# EAGLE design ArtemisDevKit (EAGLE 9.2.0)
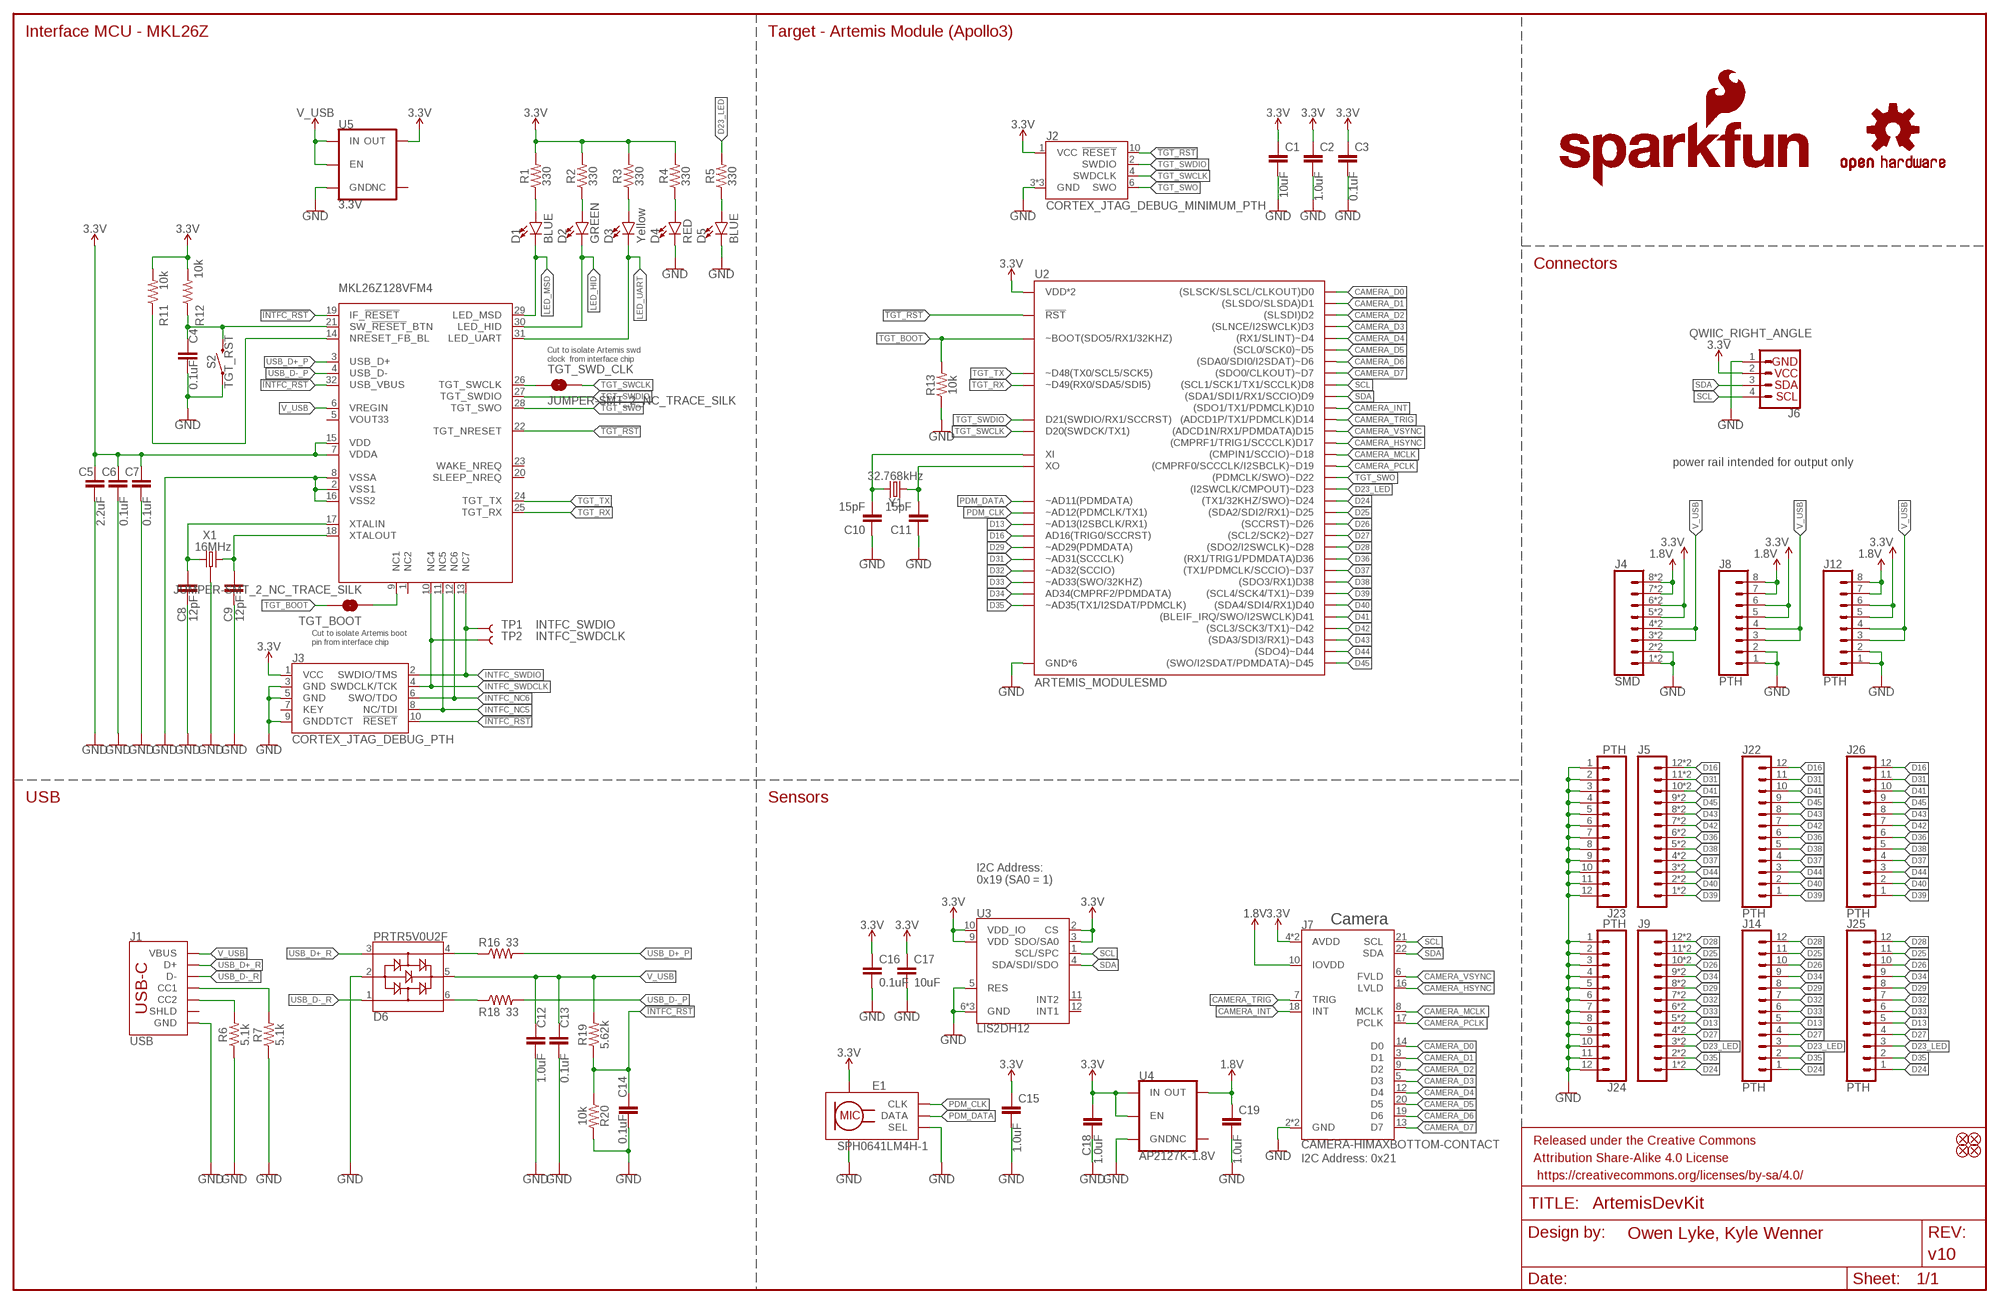
[diagram p0: schematic, sheet 1]

## Parts
C1  10uF  10UF-0603-6.3V-20%  [0603]
C2  1.0uF  1.0UF-0603-16V-10%  [0603]
C3  0.1uF  0.1UF-0603-25V-5%  [0603]
C4  0.1uF  0.1UF-0603-25V-5%  [0603]
C5  2.2uF  2.2UF-0603-10V-20%  [0603]
C6  0.1uF  0.1UF-0603-25V-5%  [0603]
C7  0.1uF  0.1UF-0603-25V-5%  [0603]
C8  12pF  12PF-0603-50V-5%  [0603]
C9  12pF  12PF-0603-50V-5%  [0603]
C10  15pF  15PF-0603-50V-5%  [0603]
C11  15pF  15PF-0603-50V-5%  [0603]
C12  1.0uF  1.0UF-0603-16V-10%  [0603]
C13  0.1uF  0.1UF-0603-25V-5%  [0603]
C14  0.1uF  0.1UF-0603-25V-5%  [0603]
C15  1.0uF  1.0UF-0603-16V-10%  [0603]
C16  0.1uF  0.1UF-0603-25V-5%  [0603]
C17  10uF  10UF-0603-6.3V-20%  [0603]
C18  1.0uF  1.0UF-0603-16V-10%  [0603]
C19  1.0uF  1.0UF-0603-16V-10%  [0603]
D1  BLUE  LED-BLUE0603  [LED-0603]
D2  GREEN  LED-GREEN0603  [LED-0603]
D3  Yellow  LED-YELLOW0603  [LED-0603]
D4  RED  LED-RED0603  [LED-0603]
D5  BLUE  LED-BLUE0603  [LED-0603]
D6  PRTR5V0U2F  [SOT886]
E1  SPH0641LM4H-1  SPH0641LM4H-1_MICROPHONE  [SPH0641LM4H-1_MICROPHONE]
FD1  FIDUCIAL1X2  [FIDUCIAL-1X2]
FD2  FIDUCIAL1X2  [FIDUCIAL-1X2]
FD3  FIDUCIAL1X2  [FIDUCIAL-1X2]
FD4  FIDUCIAL1X2  [FIDUCIAL-1X2]
FRAME1  FRAME-LEDGER  [CREATIVE_COMMONS]
J1  USB  USB_C_2-LAYER  [USB-C-16P]
J2  CORTEX_JTAG_DEBUG_MINIMUM_PTH  [2X5-PTH-1.27MM]
J3  CORTEX_JTAG_DEBUG_PTH  [2X5-PTH-1.27MM]
J4  SMD  CONN_08SMD-COMBO-FEMALE  [1X08_SMD_COMBINED]
J5  CONN_12SMD_COMBINED  [1X12_SMD_COMBINED]
J6  QWIIC_RIGHT_ANGLE  QWIIC_CONNECTORJS-1MM  [JST04_1MM_RA]
J7  CAMERA-HIMAXBOTTOM-CONTACT  [FPC-24-AMPHENOL-SFV24R-1STE1HLF]
J8  PTH  CONN_08NO_SILK_DNP  [1X08_NO_SILK]
J9  CONN_12SMD_COMBINED  [1X12_SMD_COMBINED]
J12  PTH  CONN_08NO_SILK_DNP  [1X08_NO_SILK]
J14  PTH  CONN_12NO_SILK  [1X12_NO_SILK]
J22  PTH  CONN_12NO_SILK  [1X12_NO_SILK]
J23  PTH  CONN_12NO_SILK  [1X12_NO_SILK]
J24  PTH  CONN_12NO_SILK  [1X12_NO_SILK]
J25  PTH  CONN_12NO_SILK  [1X12_NO_SILK]
J26  PTH  CONN_12NO_SILK  [1X12_NO_SILK]
LOGO1  OSHW-LOGOS  [OSHW-LOGO-S]
LOGO2  SFE_LOGO_NAME_FLAME.2_INCH  [SFE_LOGO_NAME_FLAME_.2]
R1  330  330OHM-0603-1/10W-1%  [0603]
R2  330  330OHM-0603-1/10W-1%  [0603]
R3  330  330OHM-0603-1/10W-1%  [0603]
R4  330  330OHM-0603-1/10W-1%  [0603]
R5  330  330OHM-0603-1/10W-1%  [0603]
R6  5.1k  5.1KOHM5.1KOHM-0603-1/10W-1%  [0603]
R7  5.1k  5.1KOHM5.1KOHM-0603-1/10W-1%  [0603]
R11  10k  10KOHM-0603-1/10W-1%  [0603]
R12  10k  10KOHM-0603-1/10W-1%  [0603]
R13  10k  10KOHM-0603-1/10W-1%  [0603]
R16  33  33OHM-0603-1/10W-1%  [0603]
R18  33  33OHM-0603-1/10W-1%  [0603]
R19  5.62k  5.62KOHM-0603-1/10W-1%  [0603]
R20  10k  10KOHM-0603-1/10W-1%  [0603]
S2  TGT_RST  MOMENTARY-SWITCH-SPST-SMD-5.2MM-TALL  [TACTILE_SWITCH_SMD_5.2MM]
TGT_BOOT  JUMPER-SMT_2_NC_TRACE_SILK  [SMT-JUMPER_2_NC_TRACE_SILK]
TGT_SWD_CLK  JUMPER-SMT_2_NC_TRACE_SILK  [SMT-JUMPER_2_NC_TRACE_SILK]
TP1  INTFC_SWDIO  TEST-POINT3  [PAD.03X.03]
TP2  INTFC_SWDCLK  TEST-POINT3  [PAD.03X.03]
U1  DAPLINK_KL26Z128VFM4  [QFN-32-NOPAD]
U2  ARTEMIS_MODULESMD  [ARTEMIS_FP]
U3  LIS2DH12  [LGA-12-LISDH12]
U4  AP2127K-1.8V  V_REG_AP2127K-1.8V  [SOT23-5]
U5  3.3V  V_REG_AP2112K-3.3V  [SOT23-5]
X1  16MHz  CRYSTAL-16MHZ_SMALL  [CRYSTAL-SMD-2X2.5MM]
Y1  32.768kHz  CRYSTAL-32.768KHZSMD-3.2X1.5  [CRYSTAL-SMD-3.2X1.5MM]

## Nets
1.8V: C19.1 J4.7 J4.7@2 J4.8 J4.8@2 J7.10(IOVDD) J8.7 J8.8 J12.7 J12.8 U4.5(OUT)
3.3V: C1.1 C2.1 C3.1 C5.1 C6.1 C7.1 C15.1 C16.1 C17.1 C18.1 E1.5(VDD) J2.1(VCC) J3.1(VCC) J4.5 J4.5@2 J4.6 J4.6@2 J6.2 J7.4(AVDD) J7.11(AVDD) J8.5 J8.6 J12.5 J12.6 R1.2 R2.2 R3.2 R4.2 R11.2 R12.2 U1.7(VDDA) U1.15(VDD) U2.VDD@36(VDD*2) U2.VDD@37(VDD*2) U3.2(CS) U3.3(SDO/SA0) U3.9(VDD) U3.10(VDD_IO) U4.1(IN) U4.3(EN) U5.5(OUT)
!INTFC_RST: C14.1 J3.10(!RESET) R19.1 R20.1 U1.19(IF_!RESET) U1.32(USB_VBUS)
!RST!_BTN: C4.1 R12.1 S2.3 U1.21(SW_!RESET!_BTN)
!TGT_RST: J2.10(!RESET) U1.22(TGT_NRESET) U2.~RST(!RST)
CAMERA_D0: J7.14(D0) U2.D0((SLSCK/SLSCL/CLKOUT)D0)
CAMERA_D1: J7.3(D1) U2.D1((SLSDO/SLSDA)D1)
CAMERA_D2: J7.9(D2) U2.D2((SLSDI)D2)
CAMERA_D3: J7.5(D3) U2.D3((SLNCE/I2SWCLK)D3)
CAMERA_D4: J7.12(D4) U2.~D4((RX1/SLINT)~D4)
CAMERA_D5: J7.20(D5) U2.~D5((SCL0/SCK0)~D5)
CAMERA_D6: J7.19(D6) U2.~D6((SDA0/SDI0/I2SDAT)~D6)
CAMERA_D7: J7.13(D7) U2.D7((SDO0/CLKOUT)~D7)
CAMERA_HSYNC: J7.16(LVLD) U2.D17((CMPRF1/TRIG1/SCCCLK)D17)
CAMERA_INT: J7.18(INT) U2.D10((SDO1/TX1/PDMCLK)D10)
CAMERA_MCLK: J7.8(MCLK) U2.~D18((CMPIN1/SCCIO)~D18)
CAMERA_PCLK: J7.17(PCLK) U2.~D19((CMPRF0/SCCCLK/I2SBCLK)~D19)
CAMERA_TRIG: J7.7(TRIG) U2.D14((ADCD1P/TX1/PDMCLK)D14)
CAMERA_VSYNC: J7.6(FVLD) U2.D15((ADCD1N/RX1/PDMDATA)D15)
D13: J9.5 J9.5@2 J14.5 J25.5 U2.~AD13(~AD13(I2SBCLK/RX1))
D16: J5.12 J5.12@2 J22.12 J26.12 U2.AD16(AD16(TRIG0/SCCRST))
D23_LED: J9.3 J9.3@2 J14.3 J25.3 R5.2 U2.~D23((I2SWCLK/CMPOUT)~D23)
D24: J9.1 J9.1@2 J14.1 J25.1 U2.~D24((TX1/32KHZ/SWO)~D24)
D25: J9.11 J9.11@2 J14.11 J25.11 U2.~D25((SDA2/SDI2/RX1)~D25)
D26: J9.10 J9.10@2 J14.10 J25.10 U2.~D26((SCCRST)~D26)
D27: J9.4 J9.4@2 J14.4 J25.4 U2.~D27((SCL2/SCK2)~D27)
D28: J9.12 J9.12@2 J14.12 J25.12 U2.~D28((SDO2/I2SWCLK)~D28)
D29: J9.8 J9.8@2 J14.8 J25.8 U2.~AD29(~AD29(PDMDATA))
D31: J5.11 J5.11@2 J22.11 J26.11 U2.~AD31(~AD31(SCCCLK))
D32: J9.7 J9.7@2 J14.7 J25.7 U2.~AD32(~AD32(SCCIO))
D33: J9.6 J9.6@2 J14.6 J25.6 U2.~AD33/SWO(~AD33(SWO/32KHZ))
D34: J9.9 J9.9@2 J14.9 J25.9 U2.AD34(AD34(CMPRF2/PDMDATA))
D35: J9.2 J9.2@2 J14.2 J25.2 U2.~AD35(~AD35(TX1/I2SDAT/PDMCLK))
D36: J5.6 J5.6@2 J22.6 J26.6 U2.D36((RX1/TRIG1/PDMDATA)D36)
D37: J5.4 J5.4@2 J22.4 J26.4 U2.~D37((TX1/PDMCLK/SCCIO)~D37)
D38: J5.5 J5.5@2 J22.5 J26.5 U2.D38((SDO3/RX1)D38)
D39: J5.1 J5.1@2 J22.1 J26.1 U2.~D39((SCL4/SCK4/TX1)~D39)
D40: J5.2 J5.2@2 J22.2 J26.2 U2.D40((SDA4/SDI4/RX1)D40)
D41: J5.10 J5.10@2 J22.10 J26.10 U2.D41((BLEIF_IRQ/SWO/I2SWCLK)D41)
D42: J5.7 J5.7@2 J22.7 J26.7 U2.~D42((SCL3/SCK3/TX1)~D42)
D43: J5.8 J5.8@2 J22.8 J26.8 U2.~D43((SDA3/SDI3/RX1)~D43)
D44: J5.3 J5.3@2 J22.3 J26.3 U2.~D44((SDO4)~D44)
D45: J5.9 J5.9@2 J22.9 J26.9 U2.~D45((SWO/I2SDAT/PDMDATA)~D45)
GND: C1.2 C2.2 C3.2 C4.2 C5.2 C6.2 C7.2 C8.2 C9.2 C10.1 C11.1 C12.2 C13.2 C14.2 C15.2 C16.2 C17.2 C18.2 C19.2 D4.C D5.C D6.2 E1.2(SEL) E1.3(GND) E1.6(GND) E1.7(GND) E1.8(GND) J1.GND J1.GND2(GND) J2.3(GND) J2.5(GND) J2.9(GND) J3.3(GND) J3.5(GND) J3.9(GNDDTCT) J4.1 J4.1@2 J4.2 J4.2@2 J6.1 J7.2(GND) J7.15(GND) J8.1 J8.2 J12.1 J12.2 J23.1 J23.2 J23.3 J23.4 J23.5 J23.6 J23.7 J23.8 J23.9 J23.10 J23.11 J23.12 J24.1 J24.2 J24.3 J24.4 J24.5 J24.6 J24.7 J24.8 J24.9 J24.10 J24.11 J24.12 R6.1 R7.1 R13.1 R20.2 S2.1 U1.2(VSS1) U1.8(VSSA) U1.16(VSS2) U2.GND@1(GND*6) U2.GND@22(GND*6) U2.GND@38(GND*6) U2.GND@39(GND*6) U2.GND@47(GND*6) U2.GND@59(GND*6) U3.5(RES) U3.6(GND) U3.7(GND) U3.8(GND) U4.2(GND) U5.2(GND) X1.P2(GND) X1.P4(GND)
INTFC_NC5: J3.8(NC/TDI) U1.11(NC5)
INTFC_NC6: J3.6(SWO/TDO) U1.12(NC6)
INTFC_SWDCLK: J3.4(SWDCLK/TCK) TP2.P$1 U1.10(NC4)
INTFC_SWDIO: J3.2(SWDIO/TMS) TP1.P$1 U1.13(NC7)
LED_HID: D2.C U1.30(LED_HID)
LED_MSD: D1.C U1.29(LED_MSD)
LED_UART: D3.C U1.31(LED_UART)
N$1: D1.A R1.1
N$2: D2.A R2.1
N$3: D3.A R3.1
N$4: J1.B5(CC2) R6.2
N$5: J1.A5(CC1) R7.2
N$6: D5.A R5.1
N$7: D4.A R4.1
N$8: D6.4 R16.1
N$9: D6.6 R18.1
N$10: R11.1 U1.14(NRESET_FB_BL)
N$12: TGT_SWD_CLK.1 U1.26(TGT_SWCLK)
N$13: C8.1 U1.17(XTALIN) X1.P1
N$14: C10.2 U2.XI Y1.P$2
N$15: C11.2 U2.XO Y1.P$1
N$16: C9.1 U1.18(XTALOUT) X1.P3
N$18: TGT_BOOT.1 U1.9(NC1)
PDM_CLK: E1.4(CLK) U2.~AD12(~AD12(PDMCLK/TX1))
PDM_DATA: E1.1(DATA) U2.~AD11(~AD11(PDMDATA))
SCL: J6.4 J7.21(SCL) U2.D8((SCL1/SCK1/TX1/SCCLK)D8) U3.1(SCL/SPC)
SDA: J6.3 J7.22(SDA) U2.D9((SDA1/SDI1/RX1/SCCIO)D9) U3.4(SDA/SDI/SDO)
TGT_BOOT: R13.2 TGT_BOOT.2 U2.BOOT(~BOOT(SDO5/RX1/32KHZ))
TGT_RX: U1.25(TGT_RX) U2.RXI-0(~D49(RX0/SDA5/SDI5))
TGT_SWCLK: J2.4(SWDCLK) TGT_SWD_CLK.2 U2.SWDCK(D20(SWDCK/TX1))
TGT_SWDIO: J2.2(SWDIO) U1.27(TGT_SWDIO) U2.SWDIO(D21(SWDIO/RX1/SCCRST))
TGT_SWO: J2.6(SWO) U1.28(TGT_SWO) U2.~D22((PDMCLK/SWO)~D22)
TGT_TX: U1.24(TGT_TX) U2.TXO-0(~D48(TX0/SCL5/SCK5))
USB_D+_P: R16.2 U1.3(USB_D+)
USB_D+_R: D6.3 J1.A6(D+) J1.B6(D+)
USB_D-_P: R18.2 U1.4(USB_D-)
USB_D-_R: D6.1 J1.A7(D-) J1.B7(D-)
V_USB: C12.1 C13.1 D6.5 J1.VBUS1(VBUS) J1.VBUS2(VBUS) J4.3 J4.3@2 J4.4 J4.4@2 J8.3 J8.4 J12.3 J12.4 R19.2 U1.6(VREGIN) U5.1(IN) U5.3(EN)
Unconnected: J1.SHLD1(SHLD) J1.SHLD2(SHLD) J1.SHLD3(SHLD) J1.SHLD4(SHLD) J1.SHLD5(SHLD) J1.SHLD6(SHLD) J1.SHLD7(SHLD) J1.SHLD8(SHLD) J3.7(KEY) J7.MNT1@0(MNT1) J7.MNT1@1(MNT1) J7.MNT2@0(MNT2) J7.MNT2@1(MNT2) U1.1(NC2) U1.5(VOUT33) U1.20(SLEEP_NREQ) U1.23(WAKE_NREQ) U3.11(INT2) U3.12(INT1) U4.4(NC) U5.4(NC)

## Notes on the sheet
- Interface MCU - MKL26Z | Target - Artemis Module (Apollo3)
- Connectors
- Cut to isolate Artemis swd
  clock  from interface chip
- power rail intended for output only
- Cut to isolate Artemis boot
  pin from interface chip
- USB | Sensors
- I2C Address:
  0x19 (SA0 = 1)
- Camera
- I2C Address: 0x21

## Library data of the parts
C1 C17 = SparkFun-Capacitors:10UF: 10.0µF ceramic capacitors A capacitor is a passive two-terminal electrical component used to store electrical energy temporarily in an electric field.; PROD_ID: CAP-11015
C2 C12 C15 C18 C19 = SparkFun-Capacitors:1.0UF: 1µF ceramic capacitors A capacitor is a passive two-terminal electrical component used to store electrical energy temporarily in an electric field.; PROD_ID: CAP-00868
C3 C4 C6 C7 C13 C14 C16 = SparkFun-Capacitors:0.1UF: 0.1µF ceramic capacitors A capacitor is a passive two-terminal electrical component used to store electrical energy temporarily in an electric field.; PROD_ID: CAP-08604
C5 = SparkFun-Capacitors:2.2UF: 2.2µF ceramic capacitors A capacitor is a passive two-terminal electrical component used to store electrical energy temporarily in an electric field.; PROD_ID: CAP-07888
C8 C9 = SparkFun-Capacitors:12PF: 12pF ceramic capacitors A capacitor is a passive two-terminal electrical component used to store electrical energy temporarily in an electric field.; PROD_ID: CAP-09137
C10 C11 = SparkFun-Capacitors:15PF: 15pF ceramic capacitors A capacitor is a passive two-terminal electrical component used to store electrical energy temporarily in an electric field.; PROD_ID: CAP-07881
D1 D5 = SparkFun-LED:LED-BLUE: Blue SMD LED Used in manufacturing of various products at SparkFun Packages: 0603 - SMD 0603 package [Product Link] <http://www.digikey.com/product-detail/en/SMLE12BC7TT86/511-1589-2-ND/1641808> 1206 - SMD1206 package [Product Link] <http://www.digikey.com/product-detail/en/lite-on-inc/LTST-C150TBKT/160-1643-1-ND/573584> SparkFun Products: ESP8266 Thing-Dev Board <https://www.sparkfun.com/products/13711> RedBoard <https://www.sparkfun.com/products/12757>; PROD_ID: DIO-08575
D2 = SparkFun-LED:LED-GREEN: Green SMD LED Used in manufacturing of various products at SparkFun Packages: 0603 - SMD 0603 package [Product Link] <http://www.futureelectronics.com/en/technologies/semiconductors/optoelectronics/leds/Pages/9894312-LTST-C190GKT.aspx?CrossPart=HSMG-C190&IM=0> LilyPad 1206 - SMD1206 LilyPad package [Product Link] <http://www.futureelectronics.com/en/Technologies/Product.aspx?ProductID=IN150NGHARVATEKCORPORATION2049943&IM=0> 1206 - SMD1206 package [Product Link] <http://www.futureelectronics.com/en/technologies/semiconductors/optoelectronics/leds/Pages/8315665-LTST-C150KGKT.aspx?IM=0> 1206 Bottom Mount -SMD 1206 Bottom Mount [Product Link] <http://www.digikey.com/product-detail/en/lite-on-inc/LTST-C230KGKT/160-1456-1-ND/386854> SparkFun Products: Pro Mini 328 -5V <https://www.sparkfun.com/products/821> RedBoard <https://www.sparkfun.com/products/12757> MP3 Trigger <https://www.sparkfun.com/products/13720> Makey Makey <https://www.sparkfun.com/products/11076>; PROD_ID: DIO-00821
D3 = SparkFun-LED:LED-YELLOW: Yellow SMD LED Used in manufacturing several products at SparkFun. Packages: 0603 - SMD 0603 package[Product Link] <http://www.kingbrightusa.com/product.asp?catalog_name=LED&product_id=APT1608SYCK> 0603 -SMART - SMART SMD 0603 package (more efficient/more expensive) [Product Link] <http://www.osram-os.com/osram_os/en/products/product-catalog/led-light-emitting-diodes/smartled-0603/ly-l29k/index.jsp> LilyPad - SMD1206 package[Product Datasheet] <https://www.sparkfun.com/datasheets/DevTools/LilyPad/Q150YUS4.pdf> SparkFun Products: Blynk Board <https://www.sparkfun.com/products/13794> IOIO-OTG <https://www.sparkfun.com/products/13613> XBee Explorer Serial <https://www.sparkfun.com/products/13225>; PROD_ID: DIO-09003
D4 = SparkFun-LED:LED-RED: Red SMD LED Used in manufacturing of most products at SparkFun Packages: 0603 - SMD 0603 package [Product Link] <http://docs.avagotech.com/docs/AV02-0551EN> 0603 SMART - SMD 0603 SMART package ( more efficient and expensive)[Product Link] <http://www.osram-os.com/Graphics/XPic2/00077099_0.pdf> 1206 - SMD1206 package [Product Link] <https://www.sparkfun.com/datasheets/DevTools/LilyPad/Q150OVS4.pdff> SparkFun Products: Pro Mini 328 -5V <https://www.sparkfun.com/products/821> RedBoard <https://www.sparkfun.com/products/12757> IOIO-OTG <https://www.sparkfun.com/products/13613>; PROD_ID: DIO-00819
D6 = SparkFun-IC-Power:PRTR5V0U2: A small ESD protection device. Most commonly used on USB D+/D- signals to protect large, expensive, or especially sensitive USB enabled devices.; PROD_ID: DIO-14084
E1 = SparkFun-Sensors:SPH0641LM4H-1_MICROPHONE: SPH0641LM4H-1 Microphone A miniature, high-performance, low power, bottom port silicon digital microphone with a single bit PDM output.; PROD_ID: IC-14361
FD1-FD4 = SparkFun-Aesthetics:FIDUCIAL: Fiducial Alignment Points Point-of-reference for pick-and-place machines and other optical instruments.
FRAME1 = SparkFun-Aesthetics:FRAME-LEDGER: Schematic Frame - Ledger Standard 11x14 US Ledger frame; DESIGNER: Owen Lyke, Kyle Wenner; REV: v10
J1 = SparkFun-Connectors:USB_C: USB Type C 16Pin Connector Super Speed pins not available on the 16-pin purely SMD connector so this part is best for USB 2.0 implementations. D1 and D2 are tied together enabling D+/- no matter which way the cable is plugged into the connector. The two channel configuration pins (CC1/2) are exposed. These are normally connected to ground via 5.1k resistors but can be reconfigured for high current/high power applications.; PROD_ID: CONN-14122
J2 = SparkFun-Connectors:CORTEX_JTAG_DEBUG_MINIMUM: Cortex Debug Connector - 10 pin Supports JTAG debug, Serial Wire debug, and Serial Wire Viewer. PTH and SMD connector options available. General Connector Information <http://infocenter.arm.com/help/topic/com.arm.doc.faqs/attached/13634/cortex_debug_connectors.pdf> Products: PTH Connector <http://www.digikey.com/product-detail/en/cnc-tech/3220-10-0100-00/1175-1627-ND/3883661> -via Digi-Key SparkFun PSoc <https://www.sparkfun.com/products/13229> SparkFun T <https://www.sparkfun.com/products/13810>
J3 = SparkFun-Connectors:CORTEX_JTAG_DEBUG: Cortex Debug Connector - 10 pin Supports JTAG debug, Serial Wire debug, and Serial Wire Viewer. PTH and SMD connector options available. General Connector Information <http://infocenter.arm.com/help/topic/com.arm.doc.faqs/attached/13634/cortex_debug_connectors.pdf> Products: PTH Connector <http://www.digikey.com/product-detail/en/cnc-tech/3220-10-0100-00/1175-1627-ND/3883661> -via Digi-Key SparkFun PSoc <https://www.sparkfun.com/products/13229> SparkFun T <https://www.sparkfun.com/products/13810>
J4 = SparkFun-Connectors:CONN_08: Multi connection point. Often used as Generic Header-pin footprint for 0.1 inch spaced/style header connections On any of the 0.1 inch spaced packages, you can populate with these: Break Away Headers - Straight <https://www.sparkfun.com/products/116> (PRT-00116) Break Away Male Headers - Right Angle <https://www.sparkfun.com/products/553> (PRT-00553) Female Headers <https://www.sparkfun.com/products/115> (PRT-00115) Break Away Headers - Machine Pin <https://www.sparkfun.com/products/117> (PRT-00117) Break Away Female Headers - Swiss Machine Pin <https://www.sparkfun.com/products/743> (PRT-00743) Arduino Stackable Header - 8 Pin <https://www.sparkfun.com/products/9279> (PRT-09279) For SCREWTERMINALS and SPRING TERMINALS visit here: Screw Terimnals on SparkFun.com <https://www.sparkfun.com/search/results?term=Screw+Terminals> (5mm/3.5mm/2.54mm spacing) This device is also useful as a general connection point to wire up your design to another part of your project. Our various solder wires solder well into these plated through hole pads. Hook-Up Wire - Assortment (Stranded, 22 AWG) <https://www.sparkfun.com/products/11375> (PRT-11375) Hook-Up Wire - Assortment (Solid Core, 22 AWG) <https://www.sparkfun.com/products/11367> (PRT-11367) View the entire wire category on our website here <https://www.sparkfun.com/categories/141> Special notes: Molex polarized connector foot print use with SKU : PRT-08231 with associated crimp pins and housings. 1MM SMD Version SKU: PRT-10208 NOTES ON THE VARIANTS LOCK and LOCK_LONGPADS... This footprint was designed to help hold the alignment of a through-hole component (i.e. 6-pin header) while soldering it into place. You may notice that each hole has been shifted either up or down by 0.005 of an inch from it's more standard position (which is a perfectly straight line). This slight alteration caused the pins (the squares in the middle) to touch the edges of the holes. Because they are alternating, it causes a "brace" to hold the component in place. 0.005 has proven to be the perfect amount of "off-center" position when using our standard breakaway headers. Although looks a little odd when you look at the bare footprint, once you have a header in there, the alteration is very hard to notice. Also,if you push a header all the way into place, it is covered up entirely on the bottom side.; PROD_ID: CONN-10204; SF_ID: PRT-11543
J5 J9 = SparkFun-Connectors:CONN_12: Multi connection point. Often used as Generic Header-pin footprint for 0.1 inch spaced/style header connections On any of the 0.1 inch spaced packages, you can populate with these: Break Away Headers - Straight <https://www.sparkfun.com/products/116> (PRT-00116) Break Away Male Headers - Right Angle <https://www.sparkfun.com/products/553> (PRT-00553) Female Headers <https://www.sparkfun.com/products/115> (PRT-00115) Break Away Headers - Machine Pin <https://www.sparkfun.com/products/117> (PRT-00117) Break Away Female Headers - Swiss Machine Pin <https://www.sparkfun.com/products/743> (PRT-00743) For SCREWTERMINALS and SPRING TERMINALS visit here: Screw Terimnals on SparkFun.com <https://www.sparkfun.com/search/results?term=Screw+Terminals> (5mm/3.5mm/2.54mm spacing) This device is also useful as a general connection point to wire up your design to another part of your project. Our various solder wires solder well into these plated through hole pads. Hook-Up Wire - Assortment (Stranded, 22 AWG) <https://www.sparkfun.com/products/11375> (PRT-11375) Hook-Up Wire - Assortment (Solid Core, 22 AWG) <https://www.sparkfun.com/products/11367> (PRT-11367) View the entire wire category on our website here <https://www.sparkfun.com/categories/141> Special notes: Molex polarized connector foot print use with SKU : PRT-08231 with associated crimp pins and housings. 1MM SMD Version SKU: PRT-10208 NOTES ON THE VARIANTS LOCK and LOCK_LONGPADS... This footprint was designed to help hold the alignment of a through-hole component (i.e. 6-pin header) while soldering it into place. You may notice that each hole has been shifted either up or down by 0.005 of an inch from it's more standard position (which is a perfectly straight line). This slight alteration caused the pins (the squares in the middle) to touch the edges of the holes. Because they are alternating, it causes a "brace" to hold the component in place. 0.005 has proven to be the perfect amount of "off-center" position when using our standard breakaway headers. Although looks a little odd when you look at the bare footprint, once you have a header in there, the alteration is very hard to notice. Also,if you push a header all the way into place, it is covered up entirely on the bottom side.; PROD_ID: CONN-15197
J6 = SparkFun-Connectors:QWIIC_CONNECTOR: SparkFun I2C Standard Qwiic Connector An SMD 1mm pitch JST connector makes it easy and quick (get it? Qwiic?) to connect I2C devices to each other. The Qwiic system <http://www.sparkfun.com/qwiic> enables fast and solderless connection between popular platforms and various sensors and actuators. We carry 200mm <https://www.sparkfun.com/products/14204>, 100mm <https://www.sparkfun.com/products/14205>, 50mm <https://www.sparkfun.com/products/14206>, and breadboard friendly <https://www.sparkfun.com/products/14207> Qwiic cables. We also offer 10 pcs strips <https://www.sparkfun.com/products/14323> the SMD connectors.; PROD_ID: CONN-13694
J7 = SparkFun-Connectors:CAMERA-HIMAX; DIGIKEY: 609-4320-2-ND; PROD_ID: CONN-14233
J8 J12 = SparkFun-Connectors:CONN_08: Multi connection point. Often used as Generic Header-pin footprint for 0.1 inch spaced/style header connections On any of the 0.1 inch spaced packages, you can populate with these: Break Away Headers - Straight <https://www.sparkfun.com/products/116> (PRT-00116) Break Away Male Headers - Right Angle <https://www.sparkfun.com/products/553> (PRT-00553) Female Headers <https://www.sparkfun.com/products/115> (PRT-00115) Break Away Headers - Machine Pin <https://www.sparkfun.com/products/117> (PRT-00117) Break Away Female Headers - Swiss Machine Pin <https://www.sparkfun.com/products/743> (PRT-00743) Arduino Stackable Header - 8 Pin <https://www.sparkfun.com/products/9279> (PRT-09279) For SCREWTERMINALS and SPRING TERMINALS visit here: Screw Terimnals on SparkFun.com <https://www.sparkfun.com/search/results?term=Screw+Terminals> (5mm/3.5mm/2.54mm spacing) This device is also useful as a general connection point to wire up your design to another part of your project. Our various solder wires solder well into these plated through hole pads. Hook-Up Wire - Assortment (Stranded, 22 AWG) <https://www.sparkfun.com/products/11375> (PRT-11375) Hook-Up Wire - Assortment (Solid Core, 22 AWG) <https://www.sparkfun.com/products/11367> (PRT-11367) View the entire wire category on our website here <https://www.sparkfun.com/categories/141> Special notes: Molex polarized connector foot print use with SKU : PRT-08231 with associated crimp pins and housings. 1MM SMD Version SKU: PRT-10208 NOTES ON THE VARIANTS LOCK and LOCK_LONGPADS... This footprint was designed to help hold the alignment of a through-hole component (i.e. 6-pin header) while soldering it into place. You may notice that each hole has been shifted either up or down by 0.005 of an inch from it's more standard position (which is a perfectly straight line). This slight alteration caused the pins (the squares in the middle) to touch the edges of the holes. Because they are alternating, it causes a "brace" to hold the component in place. 0.005 has proven to be the perfect amount of "off-center" position when using our standard breakaway headers. Although looks a little odd when you look at the bare footprint, once you have a header in there, the alteration is very hard to notice. Also,if you push a header all the way into place, it is covered up entirely on the bottom side.
J14 J22-J26 = SparkFun-Connectors:CONN_12: Multi connection point. Often used as Generic Header-pin footprint for 0.1 inch spaced/style header connections On any of the 0.1 inch spaced packages, you can populate with these: Break Away Headers - Straight <https://www.sparkfun.com/products/116> (PRT-00116) Break Away Male Headers - Right Angle <https://www.sparkfun.com/products/553> (PRT-00553) Female Headers <https://www.sparkfun.com/products/115> (PRT-00115) Break Away Headers - Machine Pin <https://www.sparkfun.com/products/117> (PRT-00117) Break Away Female Headers - Swiss Machine Pin <https://www.sparkfun.com/products/743> (PRT-00743) For SCREWTERMINALS and SPRING TERMINALS visit here: Screw Terimnals on SparkFun.com <https://www.sparkfun.com/search/results?term=Screw+Terminals> (5mm/3.5mm/2.54mm spacing) This device is also useful as a general connection point to wire up your design to another part of your project. Our various solder wires solder well into these plated through hole pads. Hook-Up Wire - Assortment (Stranded, 22 AWG) <https://www.sparkfun.com/products/11375> (PRT-11375) Hook-Up Wire - Assortment (Solid Core, 22 AWG) <https://www.sparkfun.com/products/11367> (PRT-11367) View the entire wire category on our website here <https://www.sparkfun.com/categories/141> Special notes: Molex polarized connector foot print use with SKU : PRT-08231 with associated crimp pins and housings. 1MM SMD Version SKU: PRT-10208 NOTES ON THE VARIANTS LOCK and LOCK_LONGPADS... This footprint was designed to help hold the alignment of a through-hole component (i.e. 6-pin header) while soldering it into place. You may notice that each hole has been shifted either up or down by 0.005 of an inch from it's more standard position (which is a perfectly straight line). This slight alteration caused the pins (the squares in the middle) to touch the edges of the holes. Because they are alternating, it causes a "brace" to hold the component in place. 0.005 has proven to be the perfect amount of "off-center" position when using our standard breakaway headers. Although looks a little odd when you look at the bare footprint, once you have a header in there, the alteration is very hard to notice. Also,if you push a header all the way into place, it is covered up entirely on the bottom side.
LOGO1 = SparkFun-Aesthetics:OSHW-LOGO: Open-Source Hardware (OSHW) Logo This logo indicates the piece of hardware it is found on incorporates a OSHW license and/or adheres to the definition of open source hardware found here: http://freedomdefined.org/OSHW
LOGO2 = SparkFun-Aesthetics:SFE_LOGO_NAME_FLAME: SparkFun Font Logo w/ Flame This is the SparkFun full logo. The logo on the schematic will always be the same size; the package variant is the height of the flame part of the logo. Default layer for the logo on the board is tSilk.
R1-R5 = SparkFun-Resistors:330OHM: 330Ω resistor A resistor is a passive two-terminal electrical component that implements electrical resistance as a circuit element. Resistors act to reduce current flow, and, at the same time, act to lower voltage levels within circuits. - Wikipedia; PROD_ID: RES-00818
R6 R7 = SparkFun-Resistors:5.1KOHM; PROD_ID: RES-12083
R11-R13 R20 = SparkFun-Resistors:10KOHM: 10kΩ resistor A resistor is a passive two-terminal electrical component that implements electrical resistance as a circuit element. Resistors act to reduce current flow, and, at the same time, act to lower voltage levels within circuits. - Wikipedia; PROD_ID: RES-00824
R16 R18 = SparkFun-Resistors:33OHM: 33Ω resistor A resistor is a passive two-terminal electrical component that implements electrical resistance as a circuit element. Resistors act to reduce current flow, and, at the same time, act to lower voltage levels within circuits. - Wikipedia; PROD_ID: RES-08270
R19 = SparkFun-Resistors:5.62KOHM: 5.62kΩ resistor A resistor is a passive two-terminal electrical component that implements electrical resistance as a circuit element. Resistors act to reduce current flow, and, at the same time, act to lower voltage levels within circuits. - Wikipedia; PROD_ID: RES-09823
S2 = SparkFun-Switches:MOMENTARY-SWITCH-SPST: Momentary Switch (Pushbutton) - SPST Normally-open (NO) SPST momentary switches (buttons, pushbuttons). Variants PTH-12MM - 12mm square, through-hole Momentary Pushbutton Switch - 12mm Square <https://www.sparkfun.com/products/9190> (COM-09190) PTH-6.0MM, PTH-6.0MM-KIT - 6.0mm square, through-hole Mini Pushbutton Switch <https://www.sparkfun.com/products/97> (COM-00097) KIT package intended for soldering kit's - only one side of pads' copper is exposed. PTH-RIGHT-ANGLE-KIT - Right-angle, through-hole Right Angle Tactile Button <https://www.sparkfun.com/products/10791> - Used on SparkFun BigTime Watch Kit <https://www.sparkfun.com/products/11734> SMD-12MM - 12mm square, surface-mount Tactile Button - SMD (12mm) <https://www.sparkfun.com/products/12993> (COM-12993) Used on SparkFun PicoBoard <https://www.sparkfun.com/products/11888> SMD-4.5MM - 4.5mm Square Trackball Switch Used on SparkFun Blackberry Trackballer Breakout <https://www.sparkfun.com/products/13169> SMD-4.6MMX2.8MM - 4.60mm x 2.80mm, surface mount Used on SparkFun SAMD21 Mini Breakout <https://www.sparkfun.com/products/13664> SMD-5.2MM, SMD-5.2-REDUNDANT - 5.2mm square, surface-mount Mini Pushbutton Switch - SMD <https://www.sparkfun.com/products/8720> (COM-08720) Used on Arduino Pro Mini <https://www.sparkfun.com/products/11114> REDUNDANT package connects both switch circuits together SMD-6.0X3.5MM - 6.0 x 3.5mm, surface mount Momentary Reset Switch SMD <https://www.sparkfun.com/products/8229> (COM-08229) SMD-6.2MM-TALL - 6.2mm square, surface mount Tactile Button - SMD (6mm) <https://www.sparkfun.com/products/12992> Used on SparkFun Digital Sandbox <https://www.sparkfun.com/products/12651> SMD-RIGHT-ANGLE - Right-angle, surface mount Used on SparkFun Block for Intel® Edison - Arduino <https://www.sparkfun.com/products/13036>; PROD_ID: SWCH-14139
TGT_BOOT TGT_SWD_CLK = SparkFun-Jumpers:JUMPER-SMT_2_NC_TRACE: Normally closed trace jumper This jumper has a trace between two pads so it's normally closed (NC). Use a razor knife to open the connection. For best results follow the IPC guidelines for cutting traces: Cutout at least 0.063 mm (0.005 in). Remove all loose material to clean up the cut area. Seal the cut with an approved epoxy. Reapply solder to reclose the connection.
TP1 TP2 = SparkFun-Connectors:TEST-POINT: SparkFun Test Points Bare copper test points for troubleshooting or In-Circuit-Testing. These are used by our Production team for verifying production board runs using pogo-pins on test beds. SparkFun Products: SparkFun LSM9DS1 Breakout <https://www.sparkfun.com/products/13284> SparkFun PSOC <https://www.sparkfun.com/products/13714> SparkFun Load Cell Amplifier <https://www.sparkfun.com/products/13879>
U1 = SparkFun-IC-Microcontroller:DAPLINK_KL26Z128VFM4: Unfinished! This is an interface MCU that runs DAPLink to enable advanced features for the target MCU; PROD_ID: IC-15168
U2 = SparkFun-IC-Microcontroller:ARTEMIS_MODULE: Description: The Artemis Module from SparkFun is a Cortex-M4F with BLE 5.0 running up to 96MHz and with as low power as 6uA per MHz (less than 5mW). This is the world's first module to bridge the market between hobbyists and consumer products. We've packaged all the power of a modern microcontroller into a module that is both extremely easy to use but is mass-market ready. The flexibility of the Artemis module starts with our [Arduino core](https://github.com/sparkfun/Arduino_Apollo3). You can program and use the Artemis module just like you would an Uno or any other Arduino. Time to first blink is just 5 minutes away! We built the core from the ground up, making it fast and as light weight as possible.; PROD_ID: SUB-14479
U3 = SparkFun-Sensors:LIS2DH12; DIGIKEY: 497-14851-2-ND; PROD_ID: IC-14229
U4 = SparkFun-IC-Power:V_REG_AP2127: AP2127 - 300mA CMOS LDO Regulator w/ Enable The AP2127 is CMOS process low dropout linear regulator with enable function, the regulator delivers a guaranteed 300mA (min.) continuous load current. Features Output Voltage Accuracy: ±1.5% Output Current: 300mA (Min.) Foldback Short Current Protection: 50mA Enable Function to Turn ON/OFF VOUT Low Dropout Voltage (3.3V): 250mV (Typ.) @IOUT=600mA Excellent Load Regulation: 0.2%/A (Typ.) Excellent Line Regulation: 0.02%/V (Typ.) Low Quiescent Current: 55μA (Typ.) Low Standby Current: 0.01μA (Typ.) Low Output Noise: 50μVRMS PSRR: 100Hz -65dB, 1kHz -65dB OTSD Protection Stable with 1.0μF Flexible Cap: Ceramic, Tantalum and Aluminum Electrolytic Operation Temperature Range: -40°C to 85°C ESD: MM 400V, HBM 4000V; PROD_ID: VREG-14239
U5 = SparkFun-IC-Power:V_REG_AP2112: AP2112 - 600mA CMOS LDO Regulator w/ Enable The AP2112 is CMOS process low dropout linear regulator with enable function, the regulator delivers a guaranteed 600mA (min.) continuous load current. Features Output Voltage Accuracy: ±1.5% Output Current: 600mA (Min.) Foldback Short Current Protection: 50mA Enable Function to Turn ON/OFF VOUT Low Dropout Voltage (3.3V): 250mV (Typ.) @IOUT=600mA Excellent Load Regulation: 0.2%/A (Typ.) Excellent Line Regulation: 0.02%/V (Typ.) Low Quiescent Current: 55μA (Typ.) Low Standby Current: 0.01μA (Typ.) Low Output Noise: 50μVRMS PSRR: 100Hz -65dB, 1kHz -65dB OTSD Protection Stable with 1.0μF Flexible Cap: Ceramic, Tantalum and Aluminum Electrolytic Operation Temperature Range: -40°C to 85°C ESD: MM 400V, HBM 4000V; PROD_ID: VREG-12457
X1 = SparkFun-Clocks:CRYSTAL-16MHZ_SMALL: 16 MHz Crystal Digikey Link <https://www.digikey.com/product-detail/en/epson/FA-20H-16.0000MF10Z-AJ5/SER4201TR-ND/7430936> Crystal Attributes: Frequency: 16 MHz Frequency Stability: +/- 10ppm Frequency Tolerance: +/- 10ppm Load Capacitance: 8pF ESR: 80 Ohms Operating Mode: Fundamental PAD 2 and PAD 4 are GROUNDED; PROD_ID: XTAL-14664
Y1 = SparkFun-Clocks:CRYSTAL-32.768KHZ: 32.768kHz Crystal Frequency: 32.768kHz Frequency Stability: ±20ppm Load Capacitance: 12.5pF (PTH-2X6 & SMD-3.2X1.5), 6pF (SMD-2X6) SparkFun Products: SparkFun BigTime Watch Kit <https://www.sparkfun.com/products/11734> SparkFun nRF52832 Breakout <https://www.sparkfun.com/products/13990> SparkFun Real Time Clock Module <https://www.sparkfun.com/products/12708>; PROD_ID: XTAL-13062

## Board
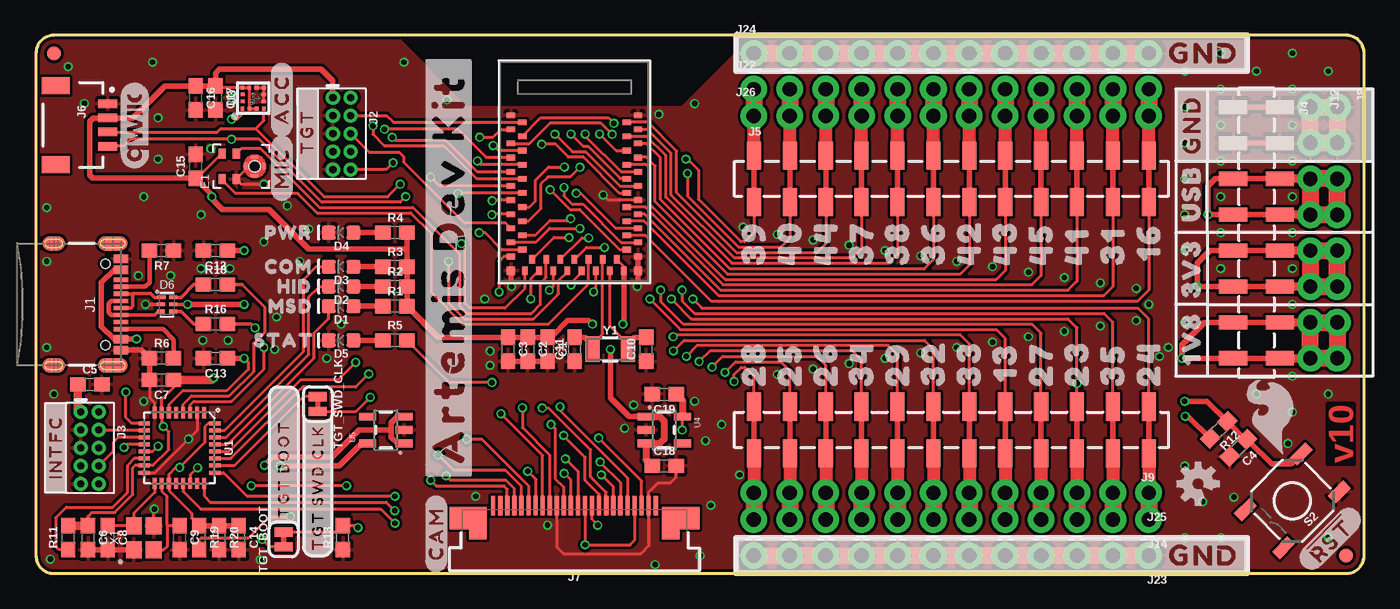
[diagram p1: board, top side]
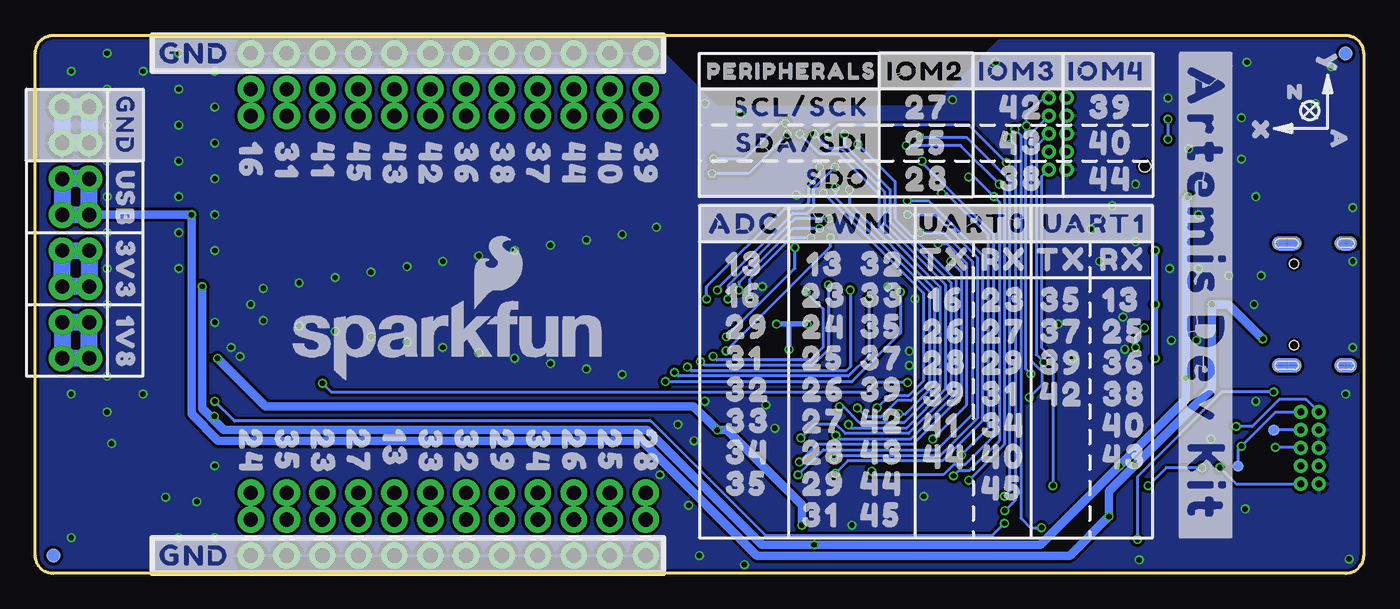
[diagram p2: board, bottom side, seen from below]

Size 93.98 x 38.1 mm. Coordinates in mm from the lower left corner, seen from the top.
Outline: 92.71,38.1 1.27,38.1 arc90 0,36.83 0,1.27 arc90 1.27,0 92.71,0 arc90 93.98,1.27 93.98,36.83 arc90 92.71,38.1
Copper layers (1*16): Top 0.035mm / dielectric 1.5mm / Bottom 0.035mm
Design rules "SparkFun-2-layer-FAB-LIMIT": minimum track width 4mil, minimum drill 6mil, track to track 4mil, track to pad 4mil, pad to pad 4mil, via to via 4mil, smd to smd 4mil, copper to edge 4mil, drill to drill 4mil, minimum pad ring 5mil, minimum via ring 5mil, stop-mask expansion 4mil, vias tented up to drill 25mil, thermal gap 10mil

### Footprints (pad centres in the part's own frame; a part is rotated, then mirrored left to right if it is on the bottom)
0603 = smd 1.1 x 1: 1 -0.85,0; 2 0.85,0
LED-0603 = smd 1 x 1: A -0.877,0; C 0.877,0
SOT886 = smd 0.61 x 0.25: 1 -0.405,0.5 | smd 0.56 x 0.25: 2 -0.43,0; 3 -0.43,-0.5; 4 0.43,-0.5; 5 0.43,0; 6 0.43,0.5
SPH0641LM4H-1_MICROPHONE = smd 0.725 x 0.522: 1 -0.9,1.3; 2 -0.9,0.3; 4 0.9,0.3; 5 0.9,1.3 | smd 0.5 x 0.2: 3 0,-1.65; 8 0,-0.35 | smd 0.2 x 0.5: 6 -0.65,-1; 7 0.65,-1 | hole 0.8: 0,-1
FIDUCIAL-1X2 = smd 1 x 1: 1 0,0
USB-C-16P = smd 0.3 x 1: A5 -1.25,-0.34; A6 -0.25,-0.34; A7 0.25,-0.34; A8 1.25,-0.34; B5 1.75,-0.34; B6 0.75,-0.34; B7 -0.75,-0.34; B8 -1.75,-0.34 | smd 0.6 x 1: GND -3.225,-0.34; GND2 3.225,-0.34; VBUS1 -2.45,-0.34; VBUS2 2.45,-0.34 | smd 1 x 2.1: SHLD1 -4.32,-0.915; SHLD2 4.32,-0.915 | smd 1 x 2.1 bottom: SHLD3 -4.32,-0.915; SHLD4 4.32,-0.915 | smd 1 x 1.6: SHLD5 -4.32,-5.095; SHLD8 4.32,-5.095 | smd 1 x 1.6 bottom: SHLD6 -4.32,-5.095; SHLD7 4.32,-5.095 | hole 0.65: -2.89,-1.445; 2.89,-1.445
2X5-PTH-1.27MM = drill 0.508 pad 1: 1 -2.54,-0.635; 2 -2.54,0.635; 3 -1.27,-0.635; 4 -1.27,0.635; 5 0,-0.635; 6 0,0.635; 7 1.27,-0.635; 8 1.27,0.635; 9 2.54,-0.635; 10 2.54,0.635
1X08_SMD_COMBINED = smd 1 x 2: 1 0,1.65; 1@2 0,-1.65; 2 2.54,-1.65; 2@2 2.54,1.65; 3 5.08,1.65; 3@2 5.08,-1.65; 4 7.62,-1.65; 4@2 7.62,1.65; 5 10.16,1.65; 5@2 10.16,-1.65; 6 12.7,-1.65; 6@2 12.7,1.65; 7 15.24,1.65; 7@2 15.24,-1.65; 8 17.78,-1.65; 8@2 17.78,1.65
1X12_SMD_COMBINED = smd 1 x 2: 1 0,1.65; 1@2 0,-1.65; 2 2.54,-1.65; 2@2 2.54,1.65; 3 5.08,1.65; 3@2 5.08,-1.65; 4 7.62,-1.65; 4@2 7.62,1.65; 5 10.16,1.65; 5@2 10.16,-1.65; 6 12.7,-1.65; 6@2 12.7,1.65; 7 15.24,1.65; 7@2 15.24,-1.65; 8 17.78,-1.65; 8@2 17.78,1.65; 9 20.32,1.65; 9@2 20.32,-1.65; 10 22.86,-1.65; 10@2 22.86,1.65; 11 25.4,1.65; 11@2 25.4,-1.65; 12 27.94,-1.65; 12@2 27.94,1.65
JST04_1MM_RA = smd 0.6 x 1.35: 1 -1.5,0; 2 -0.5,0; 3 0.5,0; 4 1.5,0 | smd 1.2 x 2: NC1 2.8,-3.675; NC2 -2.8,-3.675
FPC-24-AMPHENOL-SFV24R-1STE1HLF = smd 0.3 x 1.4: 1 5.75,2.4; 2 5.25,2.4; 3 4.75,2.4; 4 4.25,2.4; 5 3.75,2.4; 6 3.25,2.4; 7 2.75,2.4; 8 2.25,2.4; 9 1.75,2.4; 10 1.25,2.4; 11 0.75,2.4; 12 0.25,2.4; 13 -0.25,2.4; 14 -0.75,2.4; 15 -1.25,2.4; 16 -1.75,2.4; 17 -2.25,2.4; 18 -2.75,2.4; 19 -3.25,2.4; 20 -3.75,2.4; 21 -4.25,2.4; 22 -4.75,2.4; 23 -5.25,2.4; 24 -5.75,2.4 | smd 1.4 x 1.6: MNT1@0 -8.15,1.5; MNT2@1 8.15,1.5 | smd 1.25 x 2.3: MNT1@1 -6.825,1.15; MNT2@0 6.825,1.15
1X08_NO_SILK = drill 1.016 pad 1.88: 1 0,0; 2 2.54,0; 3 5.08,0; 4 7.62,0; 5 10.16,0; 6 12.7,0; 7 15.24,0; 8 17.78,0
1X12_NO_SILK = drill 1.016 pad 1.88: 1 0,0; 2 2.54,0; 3 5.08,0; 4 7.62,0; 5 10.16,0; 6 12.7,0; 7 15.24,0; 8 17.78,0; 9 20.32,0; 10 22.86,0; 11 25.4,0; 12 27.94,0
TACTILE_SWITCH_SMD_5.2MM = smd 1.524 x 0.762: 1 -2.794,1.905; 2 2.794,1.905; 3 -2.794,-1.905; 4 2.794,-1.905
SMT-JUMPER_2_NC_TRACE_SILK = smd 0.66 x 1.27: 1 -0.521,0; 2 0.521,0
PAD.03X.03 = smd 0.762 x 0.762: P$1 0,0
QFN-32-NOPAD = smd 0.285 x 0.8: 1 -1.75,-2.5; 2 -1.25,-2.5; 3 -0.75,-2.5; 4 -0.25,-2.5; 5 0.25,-2.5; 6 0.75,-2.5; 7 1.25,-2.5; 8 1.75,-2.5; 17 1.75,2.5; 18 1.25,2.5; 19 0.75,2.5; 20 0.25,2.5; 21 -0.25,2.5; 22 -0.75,2.5; 23 -1.25,2.5; 24 -1.75,2.5 | smd 0.8 x 0.285: 9 2.5,-1.75; 10 2.5,-1.25; 11 2.5,-0.75; 12 2.5,-0.25; 13 2.5,0.25; 14 2.5,0.75; 15 2.5,1.25; 16 2.5,1.75; 25 -2.5,1.75; 26 -2.5,1.25; 27 -2.5,0.75; 28 -2.5,0.25; 29 -2.5,-0.25; 30 -2.5,-0.75; 31 -2.5,-1.25; 32 -2.5,-1.75
ARTEMIS_FP = smd 0.4 x 0.6: AD16 -4,-3.7; BOOT 1.5,4.5; D0 0.5,-4.5; D1 -0.5,-4.5; D2 -1,-3.7; D3 2,-3.7; D7 -1.5,4.5; D8 -0.5,4.5; D9 2,3.7; D10 1,3.7; D14 -5,3.7; D17 -3.5,-4.5; D36 2.5,-4.5; D38 3,-3.7; D40 2.5,4.5; D41 -2.5,-4.5; GND@1 4.5,4.5; GND@39 -5.5,-4.5; GND@47 -1.5,-4.5; GND@59 4.5,-4.5; RXI-0 3.5,4.5; SWDCK 4,3.7; SWDIO 0,3.7; TXO-0 0.5,4.5; ~AD31 -3,-3.7; ~AD35 -2,3.7; ~D4 -2.5,4.5; ~D5 -1,3.7; ~D18 -4.5,-4.5; ~D19 -5,-3.7; ~D22 -3.5,4.5; ~D23 -4,3.7; ~D24 -3,3.7; ~D27 -4.5,4.5; ~D28 -5.5,4.5; ~D37 3.5,-4.5; ~D39 3,3.7; ~D42 1.5,-4.5; ~D43 1,-3.7; ~D44 4,-3.7; ~D45 -2,-3.7; ~RST 0,-3.7 | smd 0.6 x 0.4: AD34 -6.5,-0.5; D15 -6.5,0.5; VDD@36 -5.7,-3; VDD@37 -6.5,-3.5; XI -6.5,-2.5; XO -5.7,-2; ~AD11 -5.7,-1; ~AD12 -5.7,2; ~AD13 -5.7,1; ~AD29 -6.5,-1.5; ~AD32 -5.7,3; ~AD33/SWO -5.7,0; ~D6 -6.5,3.5; ~D25 -6.5,2.5; ~D26 -6.5,1.5 | smd 0.6 x 0.6: GND@22 -6.5,4.5; GND@38 -6.5,-4.5
LGA-12-LISDH12 = smd 0.275 x 0.25: 1 -0.75,0.75; 2 -0.75,0.25; 3 -0.75,-0.25; 4 -0.75,-0.75; 7 0.75,-0.75; 8 0.75,-0.25; 9 0.75,0.25; 10 0.75,0.75 | smd 0.25 x 0.275: 5 -0.25,-0.75; 6 0.25,-0.75; 11 0.25,0.75; 12 -0.25,0.75
SOT23-5 = smd 0.55 x 1.2: 1 -0.95,-1.3; 2 0,-1.3; 3 0.95,-1.3; 4 0.95,1.3; 5 -0.95,1.3
CRYSTAL-SMD-2X2.5MM = smd 1.2 x 1.1: P1 0.846,0.69; P2 -0.854,0.69; P3 -0.854,-0.71; P4 0.846,-0.71
CRYSTAL-SMD-3.2X1.5MM = smd 1 x 1.8: P$1 -1.25,0; P$2 1.25,0

### Placement (x,y rotation side)
C1  36.2,15.88 270 top
C2  34.8,15.88 270 top
C3  33.4,15.88 270 top
C4  85.09,8.89 225 top
C5  3.81,13.39 0 top
C6  3.68,2.54 270 top
C7  8.89,13.72 180 top
C8  5.08,2.54 270 top
C9  10.16,2.54 270 top
C10  43.18,15.88 90 top
C11  38.1,15.88 90 top
C12  12.7,22.86 180 top
C13  12.7,15.24 180 top
C14  14.35,2.54 270 top
C15  11.3,28.83 90 top
C16  11.3,33.66 270 top
C17  12.7,33.66 270 top
C18  44.45,7.62 0 top
C19  44.45,12.7 180 top
D1  21.59,18.92 180 top
D2  21.59,20.32 180 top
D3  21.59,21.72 180 top
D4  21.59,24.13 180 top
D5  21.59,16.51 180 top
D6  9.27,19.05 0 top
E1  14.48,28.83 90 top
FD1  1.27,36.83 0 top
FD2  1.27,36.83 0 bottom
FD3  92.71,1.27 0 top
FD4  92.71,1.27 0 bottom
FRAME1  24.13,-16.51 0 top  (outside the outline)
J1  6.35,19.05 270 top
J2  21.64,31.14 270 top
J3  3.81,8.89 270 top
J4  86.36,33.02 270 top
J5  50.8,27.94 0 top
J6  5.08,31.75 270 top
J7  38.1,2.41 0 top
J8  92.08,33.02 270 top
J9  78.74,10.16 180 top
J12  90.17,33.02 270 top
J14  78.74,3.81 180 top
J22  50.8,34.29 0 top
J23  78.74,1.27 180 top
J24  50.8,36.83 0 top
J25  78.74,5.71 180 top
J26  50.8,32.38 0 top
LOGO1  82.23,6.35 45 top
LOGO2  64.77,16.51 0 bottom
R1  25.4,18.92 0 top
R2  25.4,20.32 0 top
R3  25.4,21.72 0 top
R4  25.4,24.13 0 top
R5  25.4,16.51 0 top
R6  8.89,15.24 0 top
R7  8.89,22.86 180 top
R11  2.29,2.54 90 top
R12  83.69,10.16 225 top
R13  21.72,2.54 90 top
R16  12.7,17.65 0 top
R18  12.7,20.45 0 top
R19  11.56,2.54 270 top
R20  12.95,2.54 270 top
S2  88.9,5.14 225 top
TGT_BOOT  17.53,2.41 90 top
TGT_SWD_CLK  19.94,12 270 top
TP1  8.89,7.62 0 bottom
TP2  6.35,10.16 0 bottom
U1  10.16,8.89 180 top
U2  38.1,27.94 90 top
U3  15.37,33.66 90 top
U4  44.45,10.16 270 top
U5  24.77,10.16 90 top
U$1  [#GND#10]  86.36,1.27 0 bottom
U$2  [#GND#10]  86.36,36.83 0 bottom
U$3  [15_#GND#]  87.63,34.8 270 bottom
U$4  [16_1V8]  87.63,19.18 270 bottom
U$5  [17_3V3]  87.63,24.51 270 bottom
U$6  [18_USB]  87.63,29.46 270 bottom
U$7  [33_16]  78.74,31.75 270 bottom
U$8  [41_31]  76.2,31.75 270 bottom
U$9  [51_41]  73.66,31.75 270 bottom
U$10  [55_45]  71.12,31.75 270 bottom
U$11  [53_43]  68.58,31.75 270 bottom
U$12  [52_42]  66.04,31.75 270 bottom
U$13  [46_36]  63.5,31.75 270 bottom
U$14  [48_38]  60.96,31.75 270 bottom
U$15  [47_37]  58.42,31.75 270 bottom
U$16  [54_44]  55.88,31.75 270 bottom
U$17  [50_40]  53.34,31.75 270 bottom
U$18  [49_39]  50.8,31.75 270 bottom
U$19  [35_24]  78.74,11.43 270 bottom
U$20  [45_35]  76.2,11.43 270 bottom
U$21  [34_23]  73.66,11.43 270 bottom
U$22  [38_27]  71.12,11.43 270 bottom
U$23  [32_13]  68.58,11.43 270 bottom
U$24  [43_33]  66.04,11.43 270 bottom
U$25  [42_32]  63.5,11.43 270 bottom
U$26  [40_29]  60.96,11.43 270 bottom
U$27  [44_34]  58.42,11.43 270 bottom
U$28  [37_26]  55.88,11.43 270 bottom
U$29  [36_25]  53.34,11.43 270 bottom
U$30  [39_28]  50.8,11.43 270 bottom
U$31  [19_#IOM2#]  34.8,35.56 0 bottom
U$32  [QWIIC_6MM]  6.99,31.75 90 top
U$33  [20_#IOM3#]  28.32,35.56 0 bottom
U$34  [21_#IOM4#]  21.97,35.56 0 bottom
U$35  [#TGT#3]  19.18,28.96 90 top
U$36  [#ARTEMIS_DEV_KIT#0]  11.18,37.85 270 bottom
U$37  [#SCL#SCK#23]  45.72,33.02 0 bottom
U$38  [30_#PWM#]  40.32,24.77 0 bottom
U$39  [29_#ADC#]  47.5,24.77 0 bottom
U$40  [25_#UART0#]  32.51,24.77 0 bottom
U$41  [26_#UART1#]  23.75,24.77 0 bottom
U$42  [27_TX]  32.51,22.23 0 bottom
U$43  [27_TX]  24.26,22.23 0 bottom
U$44  [28_RX]  28.19,22.23 0 bottom
U$45  [SFE_LOGO_FLAME_.2]  87.63,11.43 45 top
U$46  [28_RX]  19.81,22.23 0 bottom
U$47  [49_39]  50.8,20.64 90 top
U$48  [50_40]  53.34,20.64 90 top
U$49  [54_44]  55.88,20.64 90 top
U$50  [47_37]  58.42,20.64 90 top
U$51  [48_38]  60.96,20.64 90 top
U$52  [46_36]  63.5,20.64 90 top
U$53  [52_42]  66.04,20.64 90 top
U$54  [53_43]  68.58,20.64 90 top
U$55  [55_45]  71.12,20.64 90 top
U$56  [32_13]  40.64,21.91 0 bottom
U$57  [34_23]  40.96,19.68 0 bottom
U$58  [35_24]  40.96,17.46 0 bottom
U$59  [36_25]  40.96,15.24 0 bottom
U$60  [37_26]  40.96,13.02 0 bottom
U$61  [38_27]  40.96,10.79 0 bottom
U$62  [39_28]  40.96,8.57 0 bottom
U$63  [40_29]  40.96,6.35 0 bottom
U$64  [33_16]  32.07,19.37 0 bottom
U$65  [37_26]  32.38,17.14 0 bottom
U$66  [39_28]  32.38,14.92 0 bottom
U$67  [49_39]  32.38,12.7 0 bottom
U$68  [51_41]  32.38,10.48 0 bottom
U$69  [54_44]  32.38,8.26 0 bottom
U$70  [34_23]  28.26,19.37 0 bottom
U$71  [38_27]  28.26,17.14 0 bottom
U$72  [40_29]  28.26,14.92 0 bottom
U$73  [41_31]  28.26,12.7 0 bottom
U$74  [44_34]  28.26,10.48 0 bottom
U$75  [50_40]  28.26,8.26 0 bottom
U$76  [55_45]  28.26,6.03 0 bottom
U$77  [45_35]  24.13,19.37 0 bottom
U$78  [47_37]  24.13,17.14 0 bottom
U$79  [49_39]  24.13,14.92 0 bottom
U$80  [52_42]  24.13,12.7 0 bottom
U$81  [32_13]  19.68,19.37 0 bottom
U$82  [36_25]  19.68,17.14 0 bottom
U$83  [46_36]  19.68,14.92 0 bottom
U$84  [48_38]  19.68,12.7 0 bottom
U$85  [50_40]  19.68,10.48 0 bottom
U$86  [53_43]  19.68,8.26 0 bottom
U$87  [38_27]  33.66,33.02 0 bottom
U$88  [36_25]  33.66,30.48 0 bottom
U$89  [39_28]  33.66,27.94 0 bottom
U$90  [52_42]  26.99,33.02 0 bottom
U$91  [53_43]  26.99,30.48 0 bottom
U$92  [48_38]  26.99,27.94 0 bottom
U$93  [49_39]  20.64,33.02 0 bottom
U$94  [50_40]  20.64,30.48 0 bottom
U$95  [54_44]  20.64,27.94 0 bottom
U$96  [51_41]  73.66,20.64 90 top
U$97  [41_31]  76.2,20.64 90 top
U$98  [33_16]  78.74,20.95 90 top
U$99  [39_28]  50.8,12.06 90 top
U$100  [36_25]  53.34,12.06 90 top
U$101  [37_26]  55.88,12.06 90 top
U$102  [44_34]  58.42,12.06 90 top
U$103  [40_29]  60.96,12.06 90 top
U$104  [42_32]  63.5,12.06 90 top
U$105  [43_33]  66.04,12.06 90 top
U$106  [32_13]  68.58,12.38 90 top
U$107  [38_27]  71.12,12.06 90 top
U$108  [34_23]  73.66,12.06 90 top
U$109  [45_35]  76.2,12.06 90 top
U$110  [35_24]  78.74,12.06 90 top
U$111  [#SDA#SDI#24]  45.47,30.48 0 bottom
U$112  [#SDO#25]  40.51,27.94 0 bottom
U$113  [14_A]  1.75,30.7 270 bottom
U$114  [15_X]  7.14,31.65 0 bottom
U$115  [16_Y]  2.22,36.1 270 bottom
U$116  [17_Z]  5.08,34.19 90 bottom
U$117  [7_COM]  15.49,21.72 0 top
U$118  [8_HID]  16.38,20.32 0 top
U$119  [9_MSD]  15.75,18.92 0 top
U$120  [10_STAT]  14.73,16.51 0 top
U$121  [6_PWR]  15.49,24.13 0 top
U$122  [#ARTEMIS_DEV_KIT#1]  29.21,6.1 90 top
U$123  [#INTFC#2]  1.4,5.97 90 top
U$124  [#TGT_BOOT#4]  17.53,3.3 90 top
U$125  [#TGT_SWD_CLK#5]  19.94,1.02 90 top
U$126  [#CAM#13]  28.32,0.13 90 top
U$129  [16_1V8]  81.76,13.81 90 top
U$130  [17_3V3]  81.76,18.57 90 top
U$131  [18_USB]  81.76,23.97 90 top
U$132  [15_#GND#]  81.79,28.7 90 top
U$137  [#MIC#11]  17.4,26.42 90 top
U$138  [#ACC#12]  17.4,30.99 90 top
U$140  [14_#GND#]  78.99,36.83 0 top
U$141  [14_#GND#]  78.99,1.27 0 top
U$142  [##RST##18]  89.67,0.56 45 top
U$145  [19_PERIPHERALS]  47.31,35.56 0 bottom
U$146  [32_13]  46.35,21.91 0 bottom
U$147  [33_16]  46.35,19.68 0 bottom
U$148  [40_29]  46.35,17.46 0 bottom
U$149  [41_31]  46.35,15.24 0 bottom
U$150  [42_32]  46.35,13.02 0 bottom
U$151  [43_33]  46.35,10.79 0 bottom
U$152  [44_34]  46.35,8.57 0 bottom
U$153  [45_35]  46.35,6.35 0 bottom
U$154  [41_31]  40.96,4.13 0 bottom
U$155  [42_32]  36.83,21.91 0 bottom
U$156  [43_33]  36.83,19.68 0 bottom
U$157  [45_35]  36.83,17.46 0 bottom
U$158  [47_37]  36.83,15.24 0 bottom
U$159  [49_39]  36.83,13.02 0 bottom
U$160  [52_42]  36.83,10.79 0 bottom
U$161  [53_43]  36.83,8.57 0 bottom
U$162  [54_44]  36.83,6.35 0 bottom
U$163  [55_45]  36.83,4.13 0 bottom
X1  7.62,2.54 90 top
Y1  40.64,15.88 0 top

### Tracks (layer width: path | path; a pad name or v marks a point on that pad's centre or on a via)
1.8V  (via drill 0.38)
  Top 0.203: v45.72,10.16 45.75,10.19 U4.5 | v39.75,3.43 39.35,3.83 J7.10
  Top 0.406: J4.7 J4.7@2 82.68,17.78 81.09,16.19 v81.09,15.24 J4.8 J4.8@2
  Top 0.508: C19.1 45.75,12.25 U4.5
  Top 0.61: J4.7 J12.7 | J4.8@2 J12.8
  Top 1.219: J12.8 J12.7 J8.7 J8.8 J12.8
  Bottom 0.61: v81.09,15.24 77.69,11.84 47.4,11.84 v45.72,10.16 45.04,10.16 39.75,4.87 v39.75,3.43
  Bottom 1.219: J12.7 J8.7 J8.8 J12.8 J12.7
3.3V  (via drill 0.38)
  Top 0.203: U3.3 U3.2 U3.9 U3.10 12.8,34.41 C17.1 | U2.VDD@36 41.6,21.74 U2.VDD@37 | E1.5 13.15,29.73 11.4,27.98 C15.1 | C7.1 9.74,13.17 8.91,12.34 U1.7 8.91,10.52 v9.02,10.41 9.4,10.03 9.4,8.76 8.28,7.64 U1.15 7,7.64 6.86,7.49 6.86,5.59 5.59,4.32 3.94,4.32 3.68,4.06 C6.1 | J7.11 38.85,2.04 v38.86,2.03 42.04,2.03 42.35,2.35 J7.4
  Top 0.406: 26.25,22.99 R3.2 R2.2 R1.2 28.45,16.73 C3.1 C2.1 C1.1 36.45,16.73 37.63,17.91 39.12,17.91 v39.37,17.65 | U2.VDD@37 41.6,17.72 v41.53,17.65 | J4.5 J4.5@2 83.06,22.86 82.17,21.97 v82.17,20.32 J4.6 J4.6@2 | J2.1 21.01,34.87 20.19,35.69 12.95,35.69 12.7,35.43 C17.1 C16.1 9.11,34.51 6.85,32.25 J6.2 4.06,32.25 3.81,32 3.81,28.19 4.03,27.98 C15.1 12.45,26.84 v12.45,26.67 12.45,26.54 13.21,25.78 16.51,25.78 19.3,22.99 26.25,22.99 | U4.1 41.98,11.11 40.64,12.45 v40.64,15.88 | v81.32,11.14 81.51,11.14 R12.2 | R4.2 26.25,22.99 | v17.27,7.62 21.46,7.62 23.05,9.21 U5.5
  Top 0.508: C18.1 43.15,8.07 U4.3 44.13,9.21 44.45,9.53 44.45,10.79 44.13,11.11 U4.1
  Top 0.61: J4.5 J12.5 | J4.6@2 J12.6 | v12.57,13.84 12.45,13.72 C7.1 | J3.1 2.96,11.64 C5.1 | R11.2 C6.1
  Top 1.219: J12.5 J12.6 J8.6 J8.5 J12.5
  Bottom 0.203: J3.1 4.06,12.32 5.97,12.32 7.87,10.41 v9.02,10.41
  Bottom 0.406: v41.53,17.65 40.64,17.65 | 40.64,17.65 v39.37,17.65 | v40.64,15.88 40.64,17.65
  Bottom 0.61: v82.17,20.32 82.17,11.68 81.41,10.92 | 81.41,10.92 80.64,10.16 50.68,10.16 42.55,2.03 v38.86,2.03 22.86,2.03 v17.27,7.62 12.57,12.32 v12.57,13.84 12.57,26.54 v12.45,26.67 | 81.41,10.92 81.41,11.05 v81.32,11.14
  Bottom 1.219: J12.5 J12.6 J8.6 J8.5 J12.5
!INTFC_RST  (via drill 0.38)
  Top 0.203: R19.1 11.01,3.93 11.01,4.26 9.41,5.86 U1.19 9.41,7.03 9.89,7.5 v10.17,7.5 11.94,9.27 11.94,10.39 12.19,10.64 U1.32
  Top 0.406: R19.1 R20.1 C14.1
  Bottom 0.203: v10.17,7.5 9.02,6.35 J3.10
!RST!_BTN  (via drill 0.38)
  Top 0.203: v25.4,3.56 24.38,4.57 11.64,4.57 10.41,5.81 U1.21
  Top 0.406: 85.82,9.36 87.44,7.75 88.81,7.75 S2.3 | 85.82,9.36 C4.1 | 85.82,9.36 85.69,9.36 R12.1 82.86,12.19 v81.28,12.19
  Bottom 0.203: v25.4,3.56 26.29,2.67 42.29,2.67 50.42,10.79 79.88,10.79 v81.28,12.19
!TGT_RST  (via drill 0.38)
  Top 0.203: J2.10 24.79,28.6 v25.27,29.08 | v37.85,31.11 38.72,30.24 39.05,30.24 41.35,27.94 U2.~RST | v21.97,6.22 v15.24,6.22 | v11.43,7.49 10.91,6.97 U1.22
  Bottom 0.203: J2.10 22.78,28.09 22.78,15.99 21.97,15.18 v21.97,6.22 | v37.85,31.11 37.21,31.75 27.94,31.75 v25.27,29.08 | v11.43,7.49 13.97,7.49 v15.24,6.22
CAMERA_D0  (via drill 0.38)
  Top 0.203: J7.14 37.35,6.1 36.73,6.71 36.73,10.26 v36.45,10.54 | U2.D0 41.4,28.44 38.86,30.98 v38.86,31.11
  Bottom 0.203: v38.86,31.11 37.85,30.1 36.99,30.1 33.91,27.02 33.91,24.77 29.59,20.45 29.59,13.05 32.36,10.29 36.45,10.29 v36.45,10.54
CAMERA_D1  (via drill 0.38)
  Top 0.203: U2.D1 41.32,27.43 38.9,29.86 37.96,29.86 v36.71,31.1 | J7.3 42.85,6.55 v39.81,9.59
  Bottom 0.203: v36.71,31.1 36.71,30.36 33.53,27.18 33.53,24.93 29.21,20.61 29.21,12.89 32.2,9.91 36.68,9.91 37.33,10.55 38.85,10.55 v39.81,9.59
CAMERA_D2  (via drill 0.38)
  Top 0.203: U2.D2 41.27,26.94 38.74,29.48 37.68,29.48 36.77,30.38 v35.78,30.38 | v37.34,9.78 37.34,9.75 38.86,8.23 38.86,6.6 39.85,5.62 J7.9
  Bottom 0.203: v35.78,30.38 33.15,27.75 33.15,25.09 28.83,20.77 28.83,12.74 32.04,9.53 37.08,9.53 v37.34,9.78
CAMERA_D3  (via drill 0.38)
  Top 0.203: v39.88,31.11 41.05,29.94 U2.D3 | v37.08,11.81 37.08,11.53 41.85,6.76 J7.5
  Bottom 0.203: v39.88,31.11 38.48,29.72 37.15,29.72 34.29,26.86 34.29,24.61 29.97,20.3 29.97,13.21 32.51,10.67 35.66,10.67 36.82,11.82 37.07,11.82 v37.08,11.81
CAMERA_D4  (via drill 0.38)
  Top 0.203: U2.~D4 32.3,25.44 v32.26,25.4 | v37.47,8.12 38.35,7.23 J7.12
  Bottom 0.203: v32.26,25.4 30.34,25.4 27.3,22.36 27.3,11 29.93,8.37 37.21,8.37 v37.47,8.12
CAMERA_D5  (via drill 0.38)
  Top 0.203: U2.~D5 29.89,26.94 v29.86,26.91 | J7.20 34.35,6.17 33.21,7.31 29.54,7.31 v28.45,8.39
  Bottom 0.203: v29.86,26.91 29.5,26.91 26.54,23.95 26.54,10.3 v28.45,8.39
CAMERA_D6  (via drill 0.38)
  Top 0.203: v30.1,23.34 30.35,23.09 30.35,19.15 30.72,18.78 33.19,18.78 34.6,20.19 U2.~D6 | J7.19 34.85,6.21 31.53,9.53 v30.48,9.53
  Bottom 0.203: v30.1,23.34 29.47,23.34 28.07,21.94 28.07,11.94 v30.48,9.53
CAMERA_D7  (via drill 0.38)
  Top 0.203: U2.D7 32.33,26.44 v32.28,26.39 | J7.13 37.85,6.62 v37.38,7.09
  Bottom 0.203: v32.28,26.39 30.79,26.39 26.92,22.52 26.92,10.84 29.79,7.98 36.49,7.98 v37.38,7.09
CAMERA_HSYNC  (via drill 0.38)
  Top 0.203: U2.D17 41.02,24.44 38.54,26.92 v38.23,26.92 | v34.42,11.73 34.42,10.33 36.35,8.4 J7.16 | v38.23,26.92
  Bottom 0.203: v38.23,26.92 38.22,26.92 31.11,19.82 31.11,13.68 32.18,12.62 33.53,12.62 v34.42,11.73
CAMERA_INT  (via drill 0.38)
  Top 0.203: U2.D10 31.51,28.94 v31.24,29.21 | v34.8,7.24 35.35,6.69 J7.18
  Bottom 0.203: v31.24,29.21 31.24,29.08 26.16,24 26.16,9.76 28.18,7.74 28.98,7.74 29.73,6.99 34.54,6.99 v34.8,7.24
CAMERA_MCLK  (via drill 0.38)
  Top 0.203: U2.~D18 41.41,23.44 38.7,26.15 37.95,26.15 37.36,26.73 v37.36,27.33 | v35.81,11.71 35.84,11.68 36.32,11.68 39.24,8.76 39.24,6.86 40.35,5.75 J7.8
  Bottom 0.203: v37.36,27.33 37.36,26.61 30.73,19.98 30.73,13.53 32.02,12.24 32.99,12.24 34.15,11.08 35.19,11.08 v35.81,11.71
CAMERA_PCLK  (via drill 0.38)
  Top 0.203: J7.17 35.85,8.36 v32.89,11.32 | U2.~D19 41.29,22.94 38.47,25.77 37.79,25.77 v36.39,27.16
  Bottom 0.203: v36.39,27.16 36.39,26.17 30.35,20.14 30.35,13.37 32.41,11.32 v32.89,11.32
CAMERA_TRIG  (via drill 0.38)
  Top 0.203: v31.37,24.13 31.76,24.13 32.95,22.94 U2.D14 | J7.7 40.85,6.14 v40.01,6.99
  Bottom 0.203: v31.37,24.13 29.72,24.13 27.69,22.1 27.69,11.25 30.17,8.76 38.23,8.76 v40.01,6.99
CAMERA_VSYNC  (via drill 0.38)
  Top 0.203: U2.D15 37.6,21.34 36.98,20.73 36.98,19.81 36.91,19.74 36.91,19.73 35.21,18.03 30.32,18.03 29.21,19.15 v29.21,22.1 | v39.93,7.9 39.93,7.87 41.35,6.45 J7.6
  Bottom 0.203: v29.21,22.1 28.45,21.34 28.45,12.58 31.88,9.14 38.68,9.14 v39.93,7.9
D13  (via drill 0.38)
  Top 0.203: U2.~AD13 38.62,23.76 v39.1,23.76 | v43.43,19.43 45.59,17.27 67.94,17.27 68.58,16.64 J9.5@2 J9.5
  Top 0.914: J9.5 J25.5
  Top 1.219: J25.5 J14.5
  Bottom 0.203: v39.1,23.76 40.5,23.76 43.43,20.83 v43.43,19.43
D16
  Top 0.203: U2.AD16 43.12,23.94 47.75,19.3 77.98,19.3 78.74,20.07 J5.12 J5.12@2
  Top 0.914: J5.12@2 J26.12
  Top 1.219: J22.12 J26.12
D23_LED  (via drill 0.38)
  Top 0.203: U2.~D23 35.31,23.94 36.36,24.99 37.72,24.99 v37.84,25.12 | v32.26,13.52 29.24,13.52 R5.2 | v44.96,19.43 46.35,18.03 73.03,18.03 73.66,17.4 v73.66,13.46 J9.3@2 J9.3
  Top 0.914: J9.3 J25.3
  Top 1.219: J25.3 J14.3
  Bottom 0.203: v37.84,25.12 40.22,25.12 44.96,20.38 v44.96,19.43 | v32.26,13.52 34.49,13.52 35.18,12.83 73.03,12.83 v73.66,13.46
D24  (via drill 0.38)
  Top 0.203: v38.48,28.76 37.8,28.07 36.23,28.07 35.72,27.56 35.72,25.81 34.85,24.94 U2.~D24 | v46.48,19.43 47.12,18.8 77.98,18.8 78.74,18.03 J9.1@2 J9.1
  Top 0.914: J9.1 J25.1
  Top 1.219: J25.1 J14.1
  Bottom 0.203: v46.48,19.43 46.48,20.32 40.92,25.88 39.67,25.88 39.26,26.29 39.26,27.45 38.48,28.23 v38.48,28.76
D25  (via drill 0.38)
  Top 0.203: U2.~D25 35,20.84 v35,19.44 | v48.76,14.24 49.02,14.5 49.02,14.51 49.5,14.99 52.7,14.99 53.34,14.35 J9.11@2 J9.11
  Top 0.914: J9.11 J25.11
  Top 1.219: J25.11 J14.11
  Bottom 0.203: v35,19.44 35,15.42 36.45,13.97 48.49,13.97 v48.76,14.24
D26  (via drill 0.38)
  Top 0.203: U2.~D26 36.6,20.34 v36.32,20.07 | v47.84,14.62 48.59,15.37 55.24,15.37 55.88,14.73 J9.10 J9.10@2
  Top 0.914: J9.10@2 J25.10
  Top 1.219: J25.10 J14.10
  Bottom 0.203: v36.32,20.07 36.32,14.64 36.61,14.35 47.58,14.35 v47.84,14.62
D27  (via drill 0.38)
  Top 0.203: v38.48,24.43 36.34,24.43 35.34,23.44 U2.~D27 | v44.2,20.07 44.2,19.25 45.79,17.65 70.48,17.65 71.12,17.02 J9.4 J9.4@2
  Top 0.914: J9.4@2 J25.4
  Top 1.219: J25.4 J14.4
  Bottom 0.203: v38.48,24.43 40.37,24.43 44.2,20.61 v44.2,20.07
D28  (via drill 0.38)
  Top 0.203: U2.~D28 33.11,22.44 32.77,22.1 v32.77,19.94 | v49.4,13.59 49.4,14.1 49.91,14.61 50.16,14.61 50.8,13.97 J9.12 J9.12@2
  Top 0.914: J9.12@2 J25.12
  Top 1.219: J25.12 J14.12
  Bottom 0.203: v49.4,13.59 36.2,13.59 32.77,17.02 v32.77,19.94
D29  (via drill 0.38)
  Top 0.203: U2.~AD29 39.6,20.09 v39.45,19.94 | v46.02,15.38 46.77,16.13 60.33,16.13 60.96,15.49 J9.8 J9.8@2
  Top 0.914: J9.8@2 J25.8
  Top 1.219: J25.8 J14.8
  Bottom 0.203: v39.45,19.94 38.24,18.73 38.24,16.02 39.15,15.11 45.75,15.11 v46.02,15.38
D31
  Top 0.203: U2.~AD31 43.04,24.94 48.29,19.68 75.56,19.68 76.2,20.32 J5.11@2 J5.11
  Top 0.914: J5.11 J26.11
  Top 1.219: J22.11 J26.11
D32  (via drill 0.38)
  Top 0.203: U2.~AD32 36.65,23.79 v37.72,23.79 | v45.11,15.76 45.86,16.51 62.87,16.51 63.5,15.88 J9.7@2 J9.7
  Top 0.914: J9.7 J25.7
  Top 1.219: J25.7 J14.7
  Bottom 0.203: v45.11,15.76 37.72,23.15 v37.72,23.79
D33  (via drill 0.38)
  Top 0.203: U2.~AD33/SWO 38.95,23.09 v40.23,23.09 | v45.09,16.76 45.21,16.89 65.41,16.89 66.04,16.26 J9.6 J9.6@2
  Top 0.914: J9.6@2 J25.6
  Top 1.219: J25.6 J14.6
  Bottom 0.203: v45.09,16.76 40.23,21.62 v40.23,23.09
D34  (via drill 0.38)
  Top 0.203: U2.AD34 38.6,21.3 37.86,20.56 v37.86,20.43 | v46.93,15 47.68,15.75 57.78,15.75 58.42,15.11 J9.9@2 J9.9
  Top 0.914: J9.9 J25.9
  Top 1.219: J25.9 J14.9
  Bottom 0.203: v37.86,20.43 37.86,15.86 38.99,14.73 46.66,14.73 v46.93,15
D35  (via drill 0.38)
  Top 0.203: v37.39,28.78 36.27,28.78 35.34,27.84 35.34,26.35 34.92,25.94 U2.~AD35 | v45.72,20.07 45.72,19.3 46.61,18.41 75.56,18.41 76.2,17.78 J9.2 J9.2@2
  Top 0.914: J9.2@2 J25.2
  Top 1.219: J25.2 J14.2
  Bottom 0.203: v45.72,20.07 45.77,20.11 40.38,25.5 39.37,25.5 38.88,25.99 38.88,27.3 v37.39,28.78
D36
  Top 0.203: U2.D36 43.18,30.44 44.19,29.43 44.19,26.48 49.08,21.59 62.87,21.59 63.5,22.23 J5.6 J5.6@2
  Top 0.914: J5.6@2 J26.6
  Top 1.219: J22.6 J26.6
D37
  Top 0.203: U2.~D37 43.26,31.44 44.95,29.75 44.95,26.8 49.4,22.35 57.78,22.35 58.42,22.99 J5.4 J5.4@2
  Top 0.914: J5.4@2 J26.4
  Top 1.219: J22.4 J26.4
D38
  Top 0.203: U2.D38 43.22,30.94 44.57,29.59 44.57,26.64 49.24,21.97 60.33,21.97 60.96,22.61 J5.5@2 J5.5
  Top 0.914: J5.5 J26.5
  Top 1.219: J22.5 J26.5
D39  (via drill 0.38)
  Top 0.203: v45.98,29.34 46.1,29.34 46.86,28.57 46.86,26.5 49.87,23.5 50.16,23.5 50.8,24.13 J5.1@2 J5.1 | v40.89,31.88 40.51,32.26 35.72,32.26 U2.~D39
  Top 0.914: J5.1 J26.1
  Top 1.219: J22.1 J26.1
  Bottom 0.203: v45.98,29.34 43.82,29.34 41.28,31.88 v40.89,31.88
D40  (via drill 0.38)
  Top 0.203: U2.D40 34.92,30.44 36.36,31.88 39.98,31.88 v40.77,31.09 | v46.1,28.32 46.1,26.72 49.71,23.11 52.7,23.11 53.34,23.75 J5.2 J5.2@2
  Top 0.914: J5.2@2 J26.2
  Top 1.219: J22.2 J26.2
  Bottom 0.203: v40.77,31.09 43.54,28.32 v46.1,28.32
D41
  Top 0.203: U2.D41 43.08,25.44 48.45,20.07 73.03,20.07 73.66,20.7 J5.10 J5.10@2
  Top 0.914: J5.10@2 J26.10
  Top 1.219: J22.10 J26.10
D42
  Top 0.203: U2.~D42 42.62,29.46 43.2,29.46 43.81,28.85 43.81,26.32 48.92,21.21 65.41,21.21 66.04,21.84 J5.7@2 J5.7
  Top 0.914: J5.7 J26.7
  Top 1.219: J22.7 J26.7
D43
  Top 0.203: U2.~D43 43.18,28.94 43.43,28.69 43.43,26.17 48.76,20.83 67.94,20.83 68.58,21.46 J5.8 J5.8@2
  Top 0.914: J5.8@2 J26.8
  Top 1.219: J22.8 J26.8
D44
  Top 0.203: U2.~D44 43.3,31.94 45.33,29.91 45.33,26.95 49.55,22.73 55.24,22.73 55.88,23.37 J5.3@2 J5.3
  Top 0.914: J5.3 J26.3
  Top 1.219: J22.3 J26.3
D45
  Top 0.203: U2.~D45 43.11,25.94 48.61,20.45 70.48,20.45 71.12,21.08 J5.9@2 J5.9
  Top 0.914: J5.9 J26.9
  Top 1.219: J22.9 J26.9
GND  (via drill 0.38)
  Top 0.203: U3.8 U3.7 U3.6 U3.5 | X1.P4 8.33,4.52 v8.38,4.57 | v16.13,27.56 14.55,27.56 E1.2 14.83,28.58 E1.8 | E1.8 E1.7 E1.3 E1.6 E1.8 | U2.GND@47 40.49,26.44 v40.13,26.8 | C7.2 8.04,12.45 8.41,12.08 U1.8 | U1.16 8.41,7.14 v10.79,9.53 11.41,10.14 U1.2 | J7.15 36.85,1.89 37.34,1.4 42.8,1.4 43.35,1.95 J7.2 43.35,5.76 44.01,6.41 44.9,6.41 45.3,6.82 C18.2
  Top 0.254: D6.2 v7.75,19.05
  Top 0.406: C6.2 C8.2 X1.P2 | C7.2 R6.1 7.46,15.82 J1.GND2 | C1.2 C2.2 C3.2 | U2.GND@39 U2.GND@38 42.6,20.38 v42.55,20.32 | U2.GND@22 33.6,20.38 v33.66,20.32
  Top 1.219: J24.1 J24.2 J24.3 J24.4 J24.5 J24.6 J24.7 J24.8 J24.9 J24.10 J24.11 J24.12 | J23.12 J23.11 J23.10 J23.9 J23.8 J23.7 J23.6 J23.5 J23.4 J23.3 J23.2 J23.1 | J12.1 J8.1 J8.2 J12.2 J12.1
  Bottom 1.219: J12.1 J8.1 J8.2 J12.2 J12.1
  other vias: 13.84,33.66 12.37,30.07 16.89,15.88 17.02,18.16 20.57,15.24 47.37,9.4 48.51,10.54 49.78,6.99 47.75,4.83 2.29,35.88 0.76,25.91 7.62,26.67 8.26,36.2 26.04,36.2 11.81,16.51 13.59,16.51 32.13,15.75 32.13,14.73 11.68,21.59 13.72,21.59 11.68,25.4 17.78,26.04 19.3,24.38 18.67,22.1 16.13,23.5 3.43,33.27 44.07,32.51 7.62,12.19 7.24,21.08 91.44,35.56 80.14,16 79.5,15.37 31.11,5.46 29.08,33.53 46.61,33.27 52.45,14.1 50.04,24.51 52.45,24 54.99,23.62 60.07,22.86 57.53,23.24 62.61,22.48 65.15,22.1 67.69,21.72 70.23,21.34 72.77,20.95 75.31,20.57 77.85,20.19 78.74,19.05 54.99,14.48 60.07,15.24 57.53,14.86 62.61,15.62 65.15,16 67.69,16.38 70.23,16.76 72.77,17.14 75.31,17.53 77.85,17.91 81.28,35.56 83.82,34.29 86.36,35.56 81.28,33.02 83.82,31.75 81.28,30.48 83.82,29.21 81.28,27.94 83.82,26.67 81.28,25.4 83.82,24.13 81.28,22.86 86.36,12.7 91.44,12.7 88.9,11.43 88.58,9.21 91.44,2.54 84.77,5.4 82.55,5.08 83.82,2.54 81.28,2.54 81.28,7.62 9.53,21.08 0.76,16 0.76,22.1 21.59,17.65 81.28,17.78 88.9,13.97 88.9,19.05 88.9,24.13 88.9,26.67 88.9,29.21 83.82,21.59 88.9,21.59 88.9,31.75 83.82,36.83 88.9,36.83 88.9,34.29 1.02,1.02 15.88,0.97 46.99,1.27 1.27,12.7 31.75,19.43 43.81,0.64 41.66,10.29 36.2,3.43 42.29,11.94 46.61,12.19 8.64,32.26 8.64,29.34
  pour Top (isolate 0.203): 0,38.1 25.4,38.1 30.48,33.02 45.72,33.02 50.8,38.1 93.98,38.1 93.98,0 0,0
  pour Bottom (isolate 0.203): 0,38.1 25.4,38.1 30.48,33.02 45.72,33.02 50.8,38.1 93.98,38.1 93.98,0 0,0
INTFC_NC5
  Top 0.203: J3.8 5.48,8.65 5.48,9.29 5.83,9.64 U1.11
INTFC_NC6  (via drill 0.38)
  Top 0.203: v6.24,8.93 6.45,9.14 U1.12
  Bottom 0.203: J3.6 4.49,8.93 v6.24,8.93
INTFC_SWDCLK
  Top 0.203: U1.10 4.46,10.14 J3.4
  Bottom 0.203: J3.4 TP2.P$1
INTFC_SWDIO  (via drill 0.38)
  Top 0.203: v8.64,9.02 8.26,8.64 U1.13
  Bottom 0.203: J3.2 6.22,11.43 v8.64,9.02 8.89,8.76 TP1.P$1
LED_HID
  Top 0.203: D2.C 20.07,20.32 19.3,19.56 19.3,15.49 13.45,9.64 U1.30
LED_MSD
  Top 0.203: D1.C 20.71,18.05 19.68,17.02 19.68,15.27 13.56,9.14 U1.29
LED_UART
  Top 0.203: D3.C 19.81,21.72 18.92,20.83 18.92,15.72 13.35,10.14 U1.31
N$1
  Top 0.406: R1.1 D1.A
N$2
  Top 0.406: D2.A R2.1
N$3
  Top 0.406: R3.1 D3.A
N$4
  Top 0.305: J1.B5 8.99,17.3 9.74,16.55 R6.2
N$5
  Top 0.305: R7.2 8.04,20.61 7.73,20.3 J1.A5
N$6
  Top 0.406: D5.A R5.1
N$7
  Top 0.406: D4.A R4.1
N$8
  Top 0.254: D6.4 10.28,18.55 11.18,17.65 R16.1
N$9
  Top 0.254: D6.6 10.28,19.55 11.18,20.45 R18.1
N$10
  Top 0.203: R11.1 1.61,1.69 1.4,1.91 1.4,3.95 2.15,4.7 5.43,4.7 6.48,5.75 6.48,7.65 6.97,8.14 U1.14
N$12
  Top 0.203: TGT_SWD_CLK.1 18.94,12.52 14.05,7.64 U1.26
N$13
  Top 0.203: C8.1 X1.P1 6.93,4.26 8.41,5.74 U1.17
N$14
  Top 0.203: Y1.P$2 41.89,16.26 40.6,17.55 U2.XI
  Top 0.406: C10.2 42.36,16.73 41.89,16.26
N$15
  Top 0.203: Y1.P$1 39.39,16.26 40.1,16.97 U2.XO
  Top 0.406: Y1.P$1 39.39,16.2 38.86,16.73 C11.2
N$16
  Top 0.203: X1.P3 9.05,1.69 9.27,1.91 9.27,3.43 | C9.1 9.31,3.39 9.27,3.43 | 9.27,3.43 9.27,5.46 8.91,5.82 U1.18
N$18  (via drill 0.38)
  Top 0.203: v6.36,12.84 6.36,11.04 6.76,10.64 U1.9 | TGT_BOOT.1 16.52,1.89 v16,2.41
  Bottom 0.203: v6.36,12.84 10.02,12.84 16,6.86 v16,2.41
PDM_CLK
  Top 0.203: E1.4 14.55,30.1 15.88,30.1 20.07,25.91 26.67,25.91 29.96,22.62 29.96,18.94 30.48,18.41 35.05,18.41 35.67,19.04 35.67,20.53 36.1,20.95 U2.~AD12
PDM_DATA
  Top 0.203: E1.1 13.18,27.85 14.12,26.91 18.52,26.91 19.91,25.53 26.51,25.53 27.99,24.05 27.99,19.89 30.24,17.64 36.24,17.64 39.1,20.5 U2.~AD11
SCL  (via drill 0.38)
  Top 0.203: U3.1 14.62,32.55 14.22,32.15 v13.84,32.15 | J7.21 33.85,6.01 33.25,6.6 29.32,6.6 v29.01,6.91 | U2.D8 28.57,27.44 v27.94,28.07 | v26.16,26.68 25.77,26.29 20.22,26.29 15.78,30.73 v13.84,30.73 6.71,30.73 6.22,30.25 J6.4
  Bottom 0.203: v13.84,32.15 v13.84,30.73 | v27.94,28.07 27.55,28.07 v26.16,26.68 25.78,26.3 25.78,9.4 27.88,7.3 28.62,7.3 v29.01,6.91
SDA  (via drill 0.38)
  Top 0.203: U2.D9 32.72,29.94 v32.36,30.3 | 15.55,31.5 13.08,31.5 12.83,31.25 J6.3 | 15.55,31.5 20.38,26.67 24.89,26.67 v25.78,27.56 | 15.55,31.5 16.12,32.07 U3.4 | J7.22 33.35,5.97 33.1,6.22 28.32,6.22 v27.94,6.6
  Bottom 0.203: v27.94,6.6 25.4,9.14 25.4,27.18 v25.78,27.56 28.52,30.3 v32.36,30.3
TGT_BOOT  (via drill 0.38)
  Top 0.203: U2.BOOT 31.88,29.44 29.87,31.45 v24.66,31.45 | v22.78,3.25 22.64,3.39 R13.2 21.26,2.93 TGT_BOOT.2
  Bottom 0.203: v24.66,31.45 24.26,31.04 24.26,3.94 23.57,3.25 v22.78,3.25
TGT_RX  (via drill 0.38)
  Top 0.203: U2.RXI-0 32.89,31.44 32.34,30.89 v31.39,30.89 | v25.4,5.46 14.96,5.46 13.28,7.14 U1.25
  Bottom 0.203: v31.39,30.89 28.09,30.89 25.02,27.81 25.02,5.84 v25.4,5.46
TGT_SWCLK  (via drill 0.38)
  Top 0.203: U2.SWDCK 25.3,31.94 24.83,32.41 J2.4 | TGT_SWD_CLK.2 22.66,11.48 v23.65,12.48
  Bottom 0.203: J2.4 23.55,31.14 23.55,15.07 22.73,14.26 22.73,13.4 v23.65,12.48
TGT_SWDIO  (via drill 0.38)
  Top 0.203: v23.85,31.7 23.85,31.09 24.64,30.3 28.83,30.3 31.19,27.94 U2.SWDIO | v23.55,14.13 22.62,13.21 18.86,13.21 13.79,8.14 U1.27
  Bottom 0.203: v23.55,14.13 23.88,14.46 23.88,31.67 v23.85,31.7 23.85,32.46 22.63,33.68 J2.2
TGT_SWO  (via drill 0.38)
  Top 0.203: J2.6 23.6,29.81 25.71,29.81 26.05,29.48 26.05,29.1 30.34,24.8 33.23,24.8 U2.~D22 | v22.62,14.95 21.38,13.72 18.73,13.72 13.66,8.64 U1.28
  Bottom 0.203: J2.6 23.16,30.25 23.16,15.5 v22.62,14.95
TGT_TX  (via drill 0.38)
  Top 0.203: v25.21,30.89 25.42,30.68 28.99,30.68 31.23,28.44 U2.TXO-0 | v25.39,4.45 24.78,5.05 12.34,5.05 11.91,5.49 U1.24
  Bottom 0.203: v25.21,30.89 24.64,30.32 24.64,5.19 v25.39,4.45
USB_D+_P  (via drill 0.38)
  Top 0.203: v15.49,17.4 15.24,17.65 | U1.3 10.91,11.93 11.18,12.19 13.84,12.19 16.13,14.48 v16.13,16
  Top 0.254: 15.24,17.65 R16.2
  Bottom 0.203: v15.49,17.4 16.13,16.76 v16.13,16
USB_D+_R
  Top 0.254: D6.3 8.64,18.55 8.39,18.3 J1.B6
  Top 0.305: J1.B6 5.32,18.3 5.16,18.47 5.16,19.13 5.33,19.3 J1.A6
USB_D-_P
  Top 0.203: 14.61,20.45 16.19,18.86 16.19,17.08 15.4,16.29 15.4,14.29 13.69,12.57 11.02,12.57 10.41,11.96 U1.4
  Top 0.254: 14.61,20.45 R18.2
USB_D-_R
  Top 0.254: 6.86,19.8 6.86,18.92 6.74,18.8 J1.A7 | D6.1 8.39,19.55 8.13,19.81 6.87,19.81 6.86,19.8 | 6.86,19.8 J1.B7
V_USB  (via drill 0.38)
  Top 0.203: v14.73,15.24 15.02,14.95 15.02,14.45 13.53,12.95 10.41,12.95 9.41,11.95 U1.6 | v18.01,4.04 18,4.03 16.55,4.03 15.06,2.54 11.71,2.54 11.56,2.39 R19.2
  Top 0.254: v10.73,19.05 D6.5
  Top 0.406: v7.11,16.6 J1.VBUS2 5.52,16.6 4.62,17.5 4.62,20.6 5.52,21.5 J1.VBUS1 | J4.3@2 83.44,27.94 82.93,27.43 v82.93,25.4 J4.4 | v14.73,19.05 v10.73,19.05 | v14.73,15.24 C13.1 | v14.73,22.86 C12.1 | U5.3 25.59,11.11 25.15,10.67 25.15,10.16 | U5.1 25.59,9.21 25.15,9.65 25.15,10.16 | 25.15,10.16 22.86,10.16 20.94,8.24 16.75,8.24 v16.17,7.66
  Top 0.61: J4.4@2 J12.4 | J4.3 J12.3
  Top 1.219: J12.3 J12.4 J8.4 J8.3 J12.3
  Bottom 0.406: v14.73,22.86 v14.73,19.05 v14.73,15.24
  Bottom 0.61: J12.4 v82.93,25.4 82.93,11.3 81.03,9.4 51.05,9.4 42.93,1.27 20.78,1.27 v18.01,4.04 18.01,5.82 v16.17,7.66 10.73,13.1 v10.73,19.05 9.56,19.05 v7.11,16.6
  Bottom 1.219: J12.3 J8.3 J8.4 J12.4 J12.3

### Text on the board
Top: v10
tDocu: Owen Lyke, Kyle Wenner